# EAGLE design shift_clock_v2_0 (EAGLE 9.6.2)

## Sheet 1 of 6
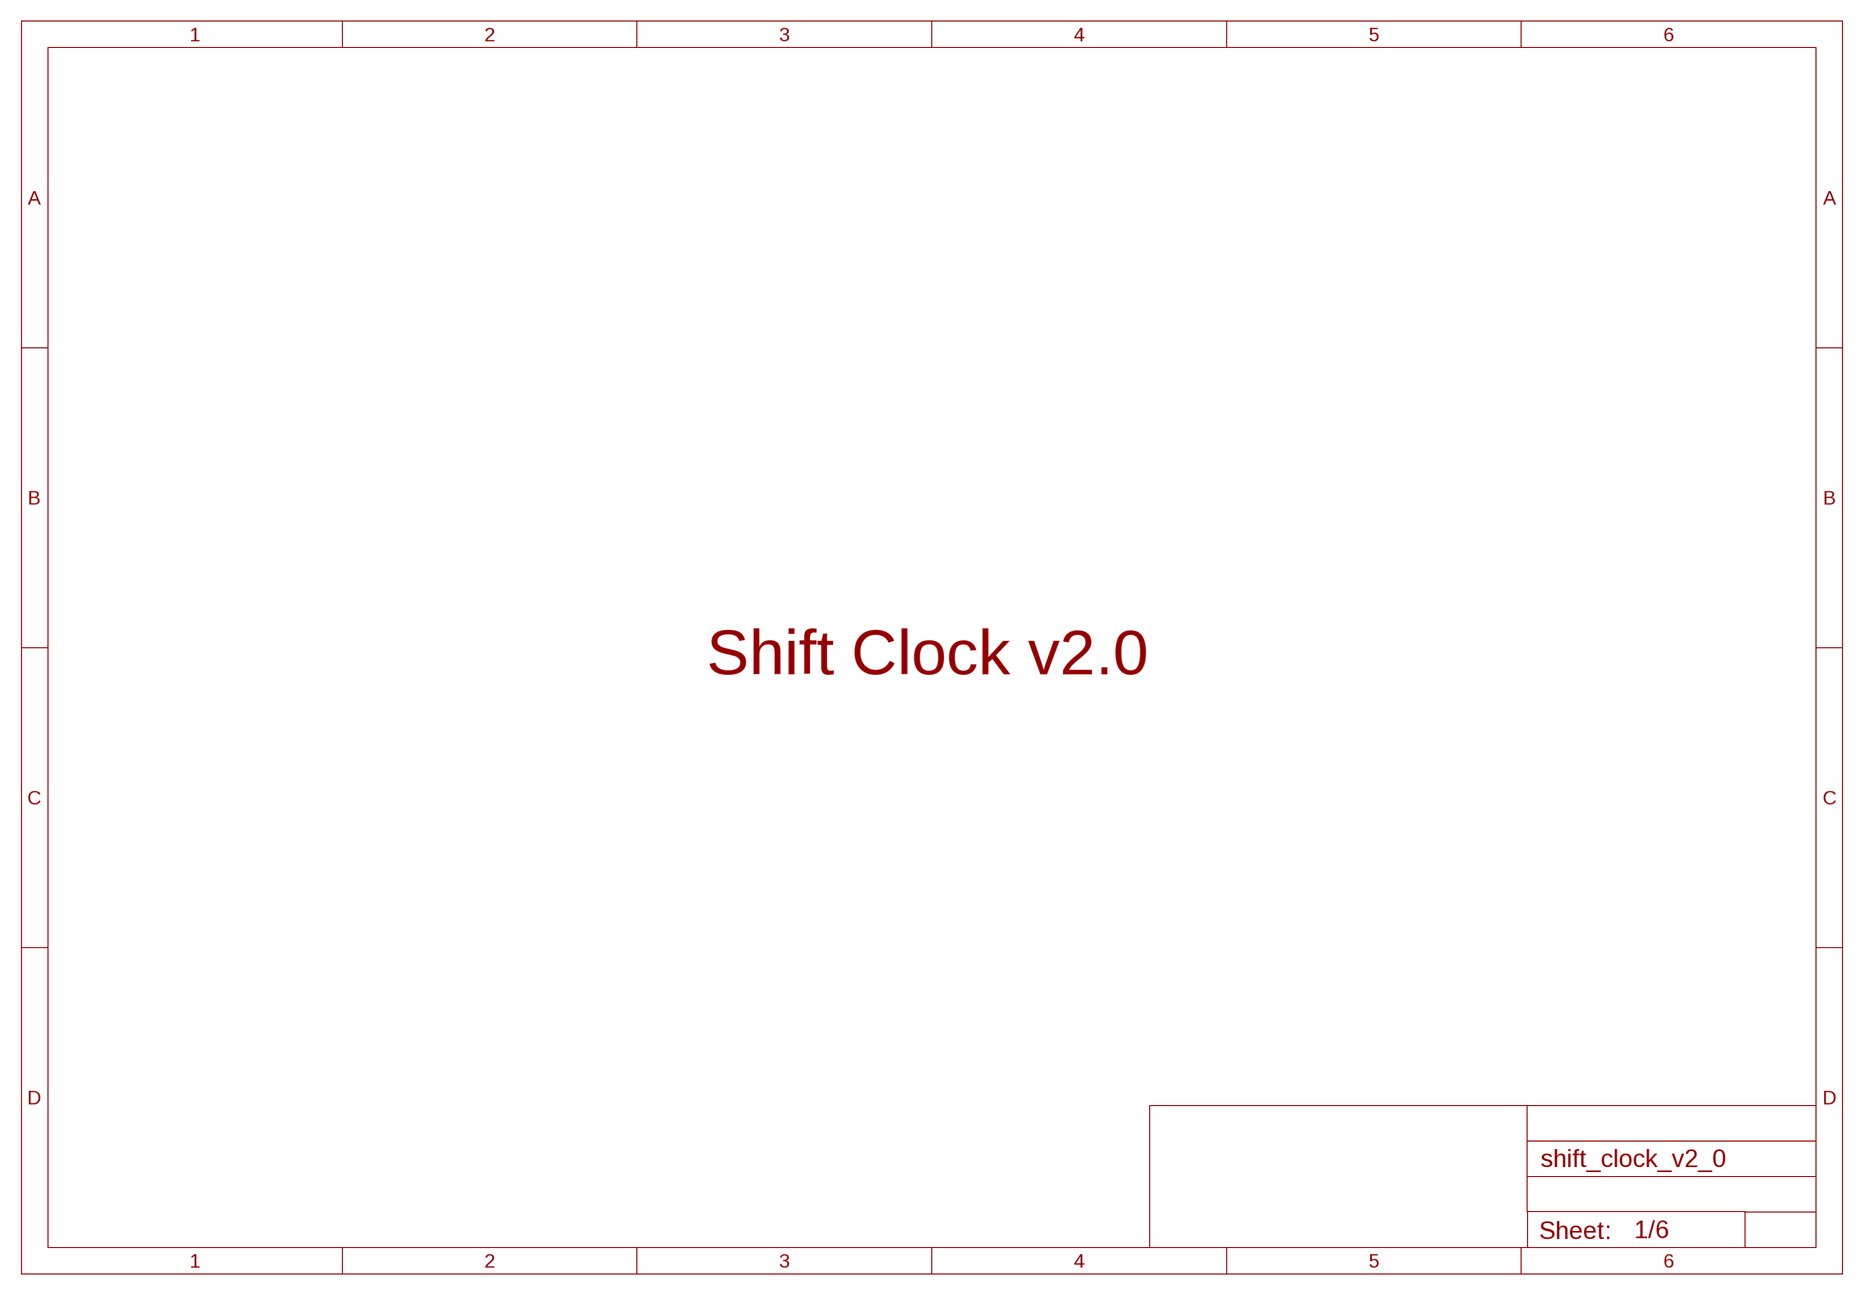
[diagram p0: schematic, sheet 1]

### Notes on the sheet
- Shift Clock v2.0

## Sheet 2 of 6
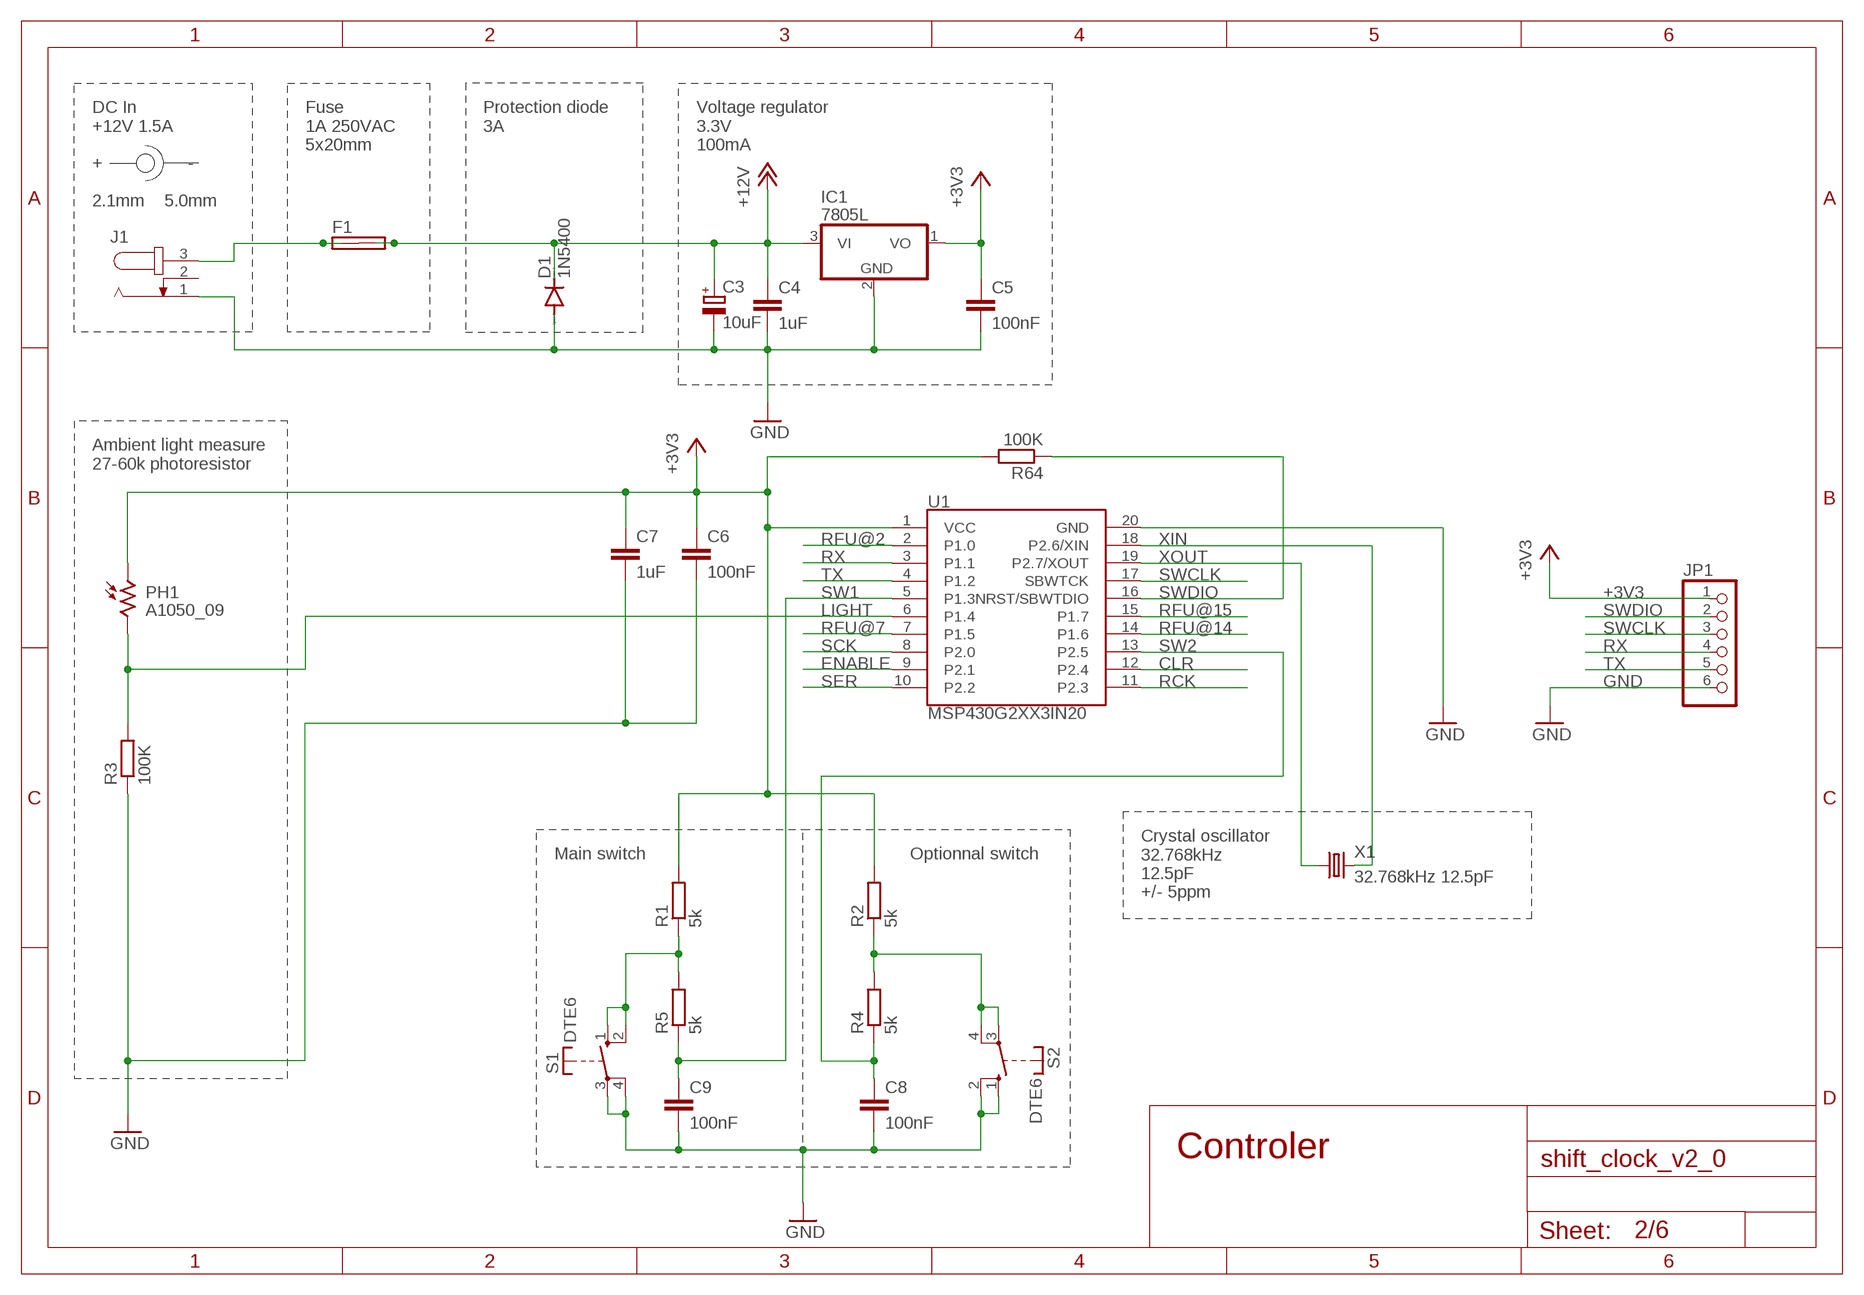
[diagram p1: schematic, sheet 2]

### Parts
C3  10uF  CPOL-EUE2.5-6  [E2,5-6]
C4  1uF  C-EU050-024X044  [C050-024X044]
C5  100nF  C-EU050-024X044  [C050-024X044]
C6  100nF  C-EU050-024X044  [C050-024X044]
C7  1uF  C-EU050-024X044  [C050-024X044]
C8  100nF  C-EU050-024X044  [C050-024X044]
C9  100nF  C-EU050-024X044  [C050-024X044]
D1  1N5400  [DO201-15]
F1  SHK20L  [SHK20L]
IC1  7805L  [TO92]
J1  JACK-PLUG0  [SPC4077]
JP1  PINHD-1X6  [1X06]
PH1  A1050_09  [T0-46-A10XX]
R1  5k  R-EU_0204/7  [0204/7]
R2  5k  R-EU_0204/7  [0204/7]
R3  100K  R-EU_0204/7  [0204/7]
R4  5k  R-EU_0204/7  [0204/7]
R5  5k  R-EU_0204/7  [0204/7]
R64  100K  R-EU_0204/7  [0204/7]
S1  DTE6  [DTE6]
S2  DTE6  [DTE6]
U1  MSP430G2XX3IN20  [DIL20]
X1  32.768kHz 12.5pF  CRYSTALTC26H  [TC26H]

### Nets
+3V3 [power_low]: C5.1 C6.1 C7.1 IC1.1(VO) JP1.1 PH1.1 R1.2 R2.2 R64.2 U1.1(VCC) ; also sheet 3,4,5,6
+12V [power_high]: C3.+ C4.1 D1.C F1.2A F1.2B IC1.3(VI) ; also sheet 3,4,5,6
CLR: U1.12(P2.4) ; also sheet 3,4,5,6
ENABLE: U1.9(P2.1) ; also sheet 3,4,5,6
GND: C3.- C4.2 C5.2 C6.2 C7.2 C8.2 C9.2 D1.A IC1.2(GND) J1.1 JP1.6 R3.1 S1.3(P) S1.4(P) S2.1(S) S2.2(S) U1.20(GND) ; also sheet 3,4,5,6
LIGHT: PH1.2 R3.2 U1.6(P1.4)
N$1 [power_high]: F1.1A F1.1B J1.3
N$3: R2.1 R4.2 S2.3(P) S2.4(P)
N$4: R1.1 R5.2 S1.1(S) S1.2(S)
RCK: U1.11(P2.3) ; also sheet 3,4,5,6
RFU@2: U1.2(P1.0)
RFU@7: U1.7(P1.5)
RFU@14: U1.14(P1.6)
RFU@15: U1.15(P1.7)
RX: JP1.4 U1.3(P1.1)
SCK: U1.8(P2.0) ; also sheet 3,4,5,6
SER: U1.10(P2.2) ; also sheet 3
SW1: C9.1 R5.1 U1.5(P1.3)
SW2: C8.1 R4.1 U1.13(P2.5)
SWCLK: JP1.3 U1.17(SBWTCK)
SWDIO: JP1.2 R64.1 U1.16(NRST/SBWTDIO)
TX: JP1.5 U1.4(P1.2)
XIN: U1.18(P2.6/XIN) X1.2
XOUT: U1.19(P2.7/XOUT) X1.1
Unconnected: J1.2

### Notes on the sheet
- DC In
  +12V 1.5A
  
  +                 -
  
  2.1mm    5.0mm
- Fuse
  1A 250VAC
  5x20mm
- Protection diode
  3A
- Voltage regulator
  3.3V
  100mA
- Ambient light measure
  27-60k photoresistor
- Crystal oscillator
  32.768kHz
  12.5pF
  +/- 5ppm
- Main switch | Optionnal switch
- Controler

## Sheet 3 of 6
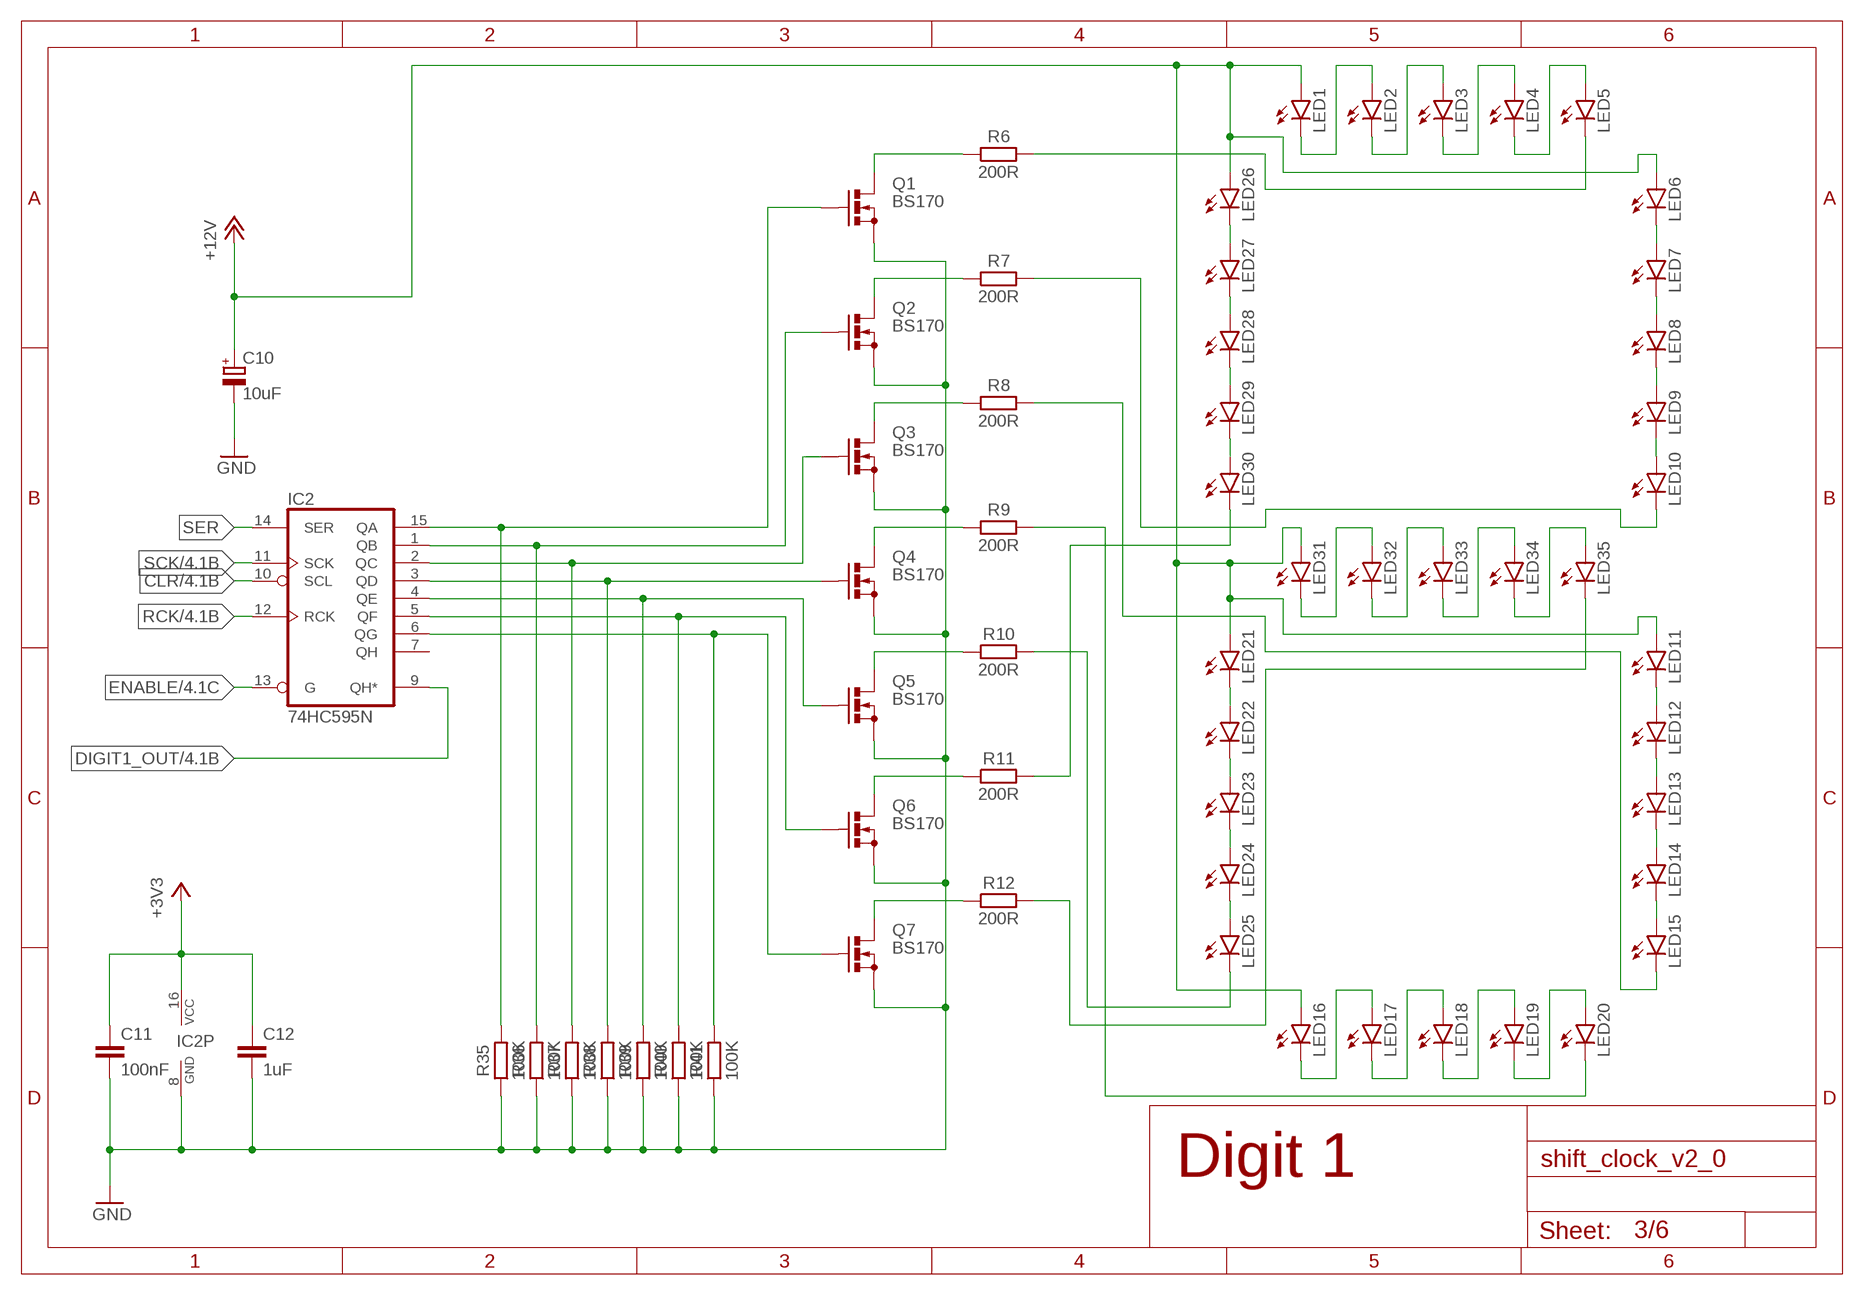
[diagram p2: schematic, sheet 3]

### Parts
C10  10uF  CPOL-EUE2.5-6  [E2,5-6]
C11  100nF  C-EU050-024X044  [C050-024X044]
C12  1uF  C-EU050-024X044  [C050-024X044]
IC2  74HC595N  [DIL16]
LED1  LED25X70  [LED25X70]
LED2  LED25X70  [LED25X70]
LED3  LED25X70  [LED25X70]
LED4  LED25X70  [LED25X70]
LED5  LED25X70  [LED25X70]
LED6  LED25X70  [LED25X70]
LED7  LED25X70  [LED25X70]
LED8  LED25X70  [LED25X70]
LED9  LED25X70  [LED25X70]
LED10  LED25X70  [LED25X70]
LED11  LED25X70  [LED25X70]
LED12  LED25X70  [LED25X70]
LED13  LED25X70  [LED25X70]
LED14  LED25X70  [LED25X70]
LED15  LED25X70  [LED25X70]
LED16  LED25X70  [LED25X70]
LED17  LED25X70  [LED25X70]
LED18  LED25X70  [LED25X70]
LED19  LED25X70  [LED25X70]
LED20  LED25X70  [LED25X70]
LED21  LED25X70  [LED25X70]
LED22  LED25X70  [LED25X70]
LED23  LED25X70  [LED25X70]
LED24  LED25X70  [LED25X70]
LED25  LED25X70  [LED25X70]
LED26  LED25X70  [LED25X70]
LED27  LED25X70  [LED25X70]
LED28  LED25X70  [LED25X70]
LED29  LED25X70  [LED25X70]
LED30  LED25X70  [LED25X70]
LED31  LED25X70  [LED25X70]
LED32  LED25X70  [LED25X70]
LED33  LED25X70  [LED25X70]
LED34  LED25X70  [LED25X70]
LED35  LED25X70  [LED25X70]
Q1  BS170  [SOT54E]
Q2  BS170  [SOT54E]
Q3  BS170  [SOT54E]
Q4  BS170  [SOT54E]
Q5  BS170  [SOT54E]
Q6  BS170  [SOT54E]
Q7  BS170  [SOT54E]
R6  200R  R-EU_0204/7  [0204/7]
R7  200R  R-EU_0204/7  [0204/7]
R8  200R  R-EU_0204/7  [0204/7]
R9  200R  R-EU_0204/7  [0204/7]
R10  200R  R-EU_0204/7  [0204/7]
R11  200R  R-EU_0204/7  [0204/7]
R12  200R  R-EU_0204/7  [0204/7]
R35  100K  R-EU_0204/7  [0204/7]
R36  100K  R-EU_0204/7  [0204/7]
R37  100K  R-EU_0204/7  [0204/7]
R38  100K  R-EU_0204/7  [0204/7]
R39  100K  R-EU_0204/7  [0204/7]
R40  100K  R-EU_0204/7  [0204/7]
R41  100K  R-EU_0204/7  [0204/7]

### Nets
+3V3 [power_low]: C11.1 C12.1 IC2.16(VCC) ; also sheet 2,4,5,6
+12V [power_high]: C10.+ LED1.A LED6.A LED11.A LED16.A LED21.A LED26.A LED31.A ; also sheet 2,4,5,6
CLR: IC2.10(SCL) ; also sheet 2,4,5,6
DIGIT1_OUT: IC2.9(QH*) ; also sheet 4
ENABLE: IC2.13(G) ; also sheet 2,4,5,6
GND: C10.- C11.2 C12.2 IC2.8(GND) Q1.S Q2.S Q3.S Q4.S Q5.S Q6.S Q7.S R35.1 R36.1 R37.1 R38.1 R39.1 R40.1 R41.1 ; also sheet 2,4,5,6
N$2: LED1.K(C) LED2.A
N$5: LED2.K(C) LED3.A
N$6: LED3.K(C) LED4.A
N$7: LED4.K(C) LED5.A
N$8: LED6.K(C) LED7.A
N$9: LED7.K(C) LED8.A
N$10: LED8.K(C) LED9.A
N$11: LED9.K(C) LED10.A
N$12: LED26.K(C) LED27.A
N$13: LED27.K(C) LED28.A
N$14: LED28.K(C) LED29.A
N$15: LED29.K(C) LED30.A
N$16: LED31.K(C) LED32.A
N$17: LED32.K(C) LED33.A
N$18: LED33.K(C) LED34.A
N$19: LED34.K(C) LED35.A
N$20: LED21.K(C) LED22.A
N$21: LED22.K(C) LED23.A
N$22: LED23.K(C) LED24.A
N$23: LED24.K(C) LED25.A
N$24: LED11.K(C) LED12.A
N$25: LED12.K(C) LED13.A
N$26: LED13.K(C) LED14.A
N$27: LED14.K(C) LED15.A
N$28: LED16.K(C) LED17.A
N$29: LED17.K(C) LED18.A
N$30: LED18.K(C) LED19.A
N$31: LED19.K(C) LED20.A
N$32: IC2.15(QA) Q1.G R35.2
N$33: IC2.1(QB) Q2.G R36.2
N$34: IC2.2(QC) Q3.G R37.2
N$35: IC2.3(QD) Q4.G R38.2
N$36: IC2.4(QE) Q5.G R39.2
N$37: IC2.5(QF) Q6.G R40.2
N$38: IC2.6(QG) Q7.G R41.2
N$39: Q1.D R6.1
N$40: Q2.D R7.1
N$41: Q3.D R8.1
N$42: Q4.D R9.1
N$43: Q5.D R10.1
N$44: Q6.D R11.1
N$45: Q7.D R12.1
N$46: LED5.K(C) R6.2
N$47: LED10.K(C) R7.2
N$48: LED15.K(C) R8.2
N$49: LED20.K(C) R9.2
N$50: LED25.K(C) R10.2
N$51: LED30.K(C) R11.2
N$52: LED35.K(C) R12.2
RCK: IC2.12(RCK) ; also sheet 2,4,5,6
SCK: IC2.11(SCK) ; also sheet 2,4,5,6
SER: IC2.14(SER) ; also sheet 2
Unconnected: IC2.7(QH)

### Notes on the sheet
- Digit 1

## Sheet 4 of 6
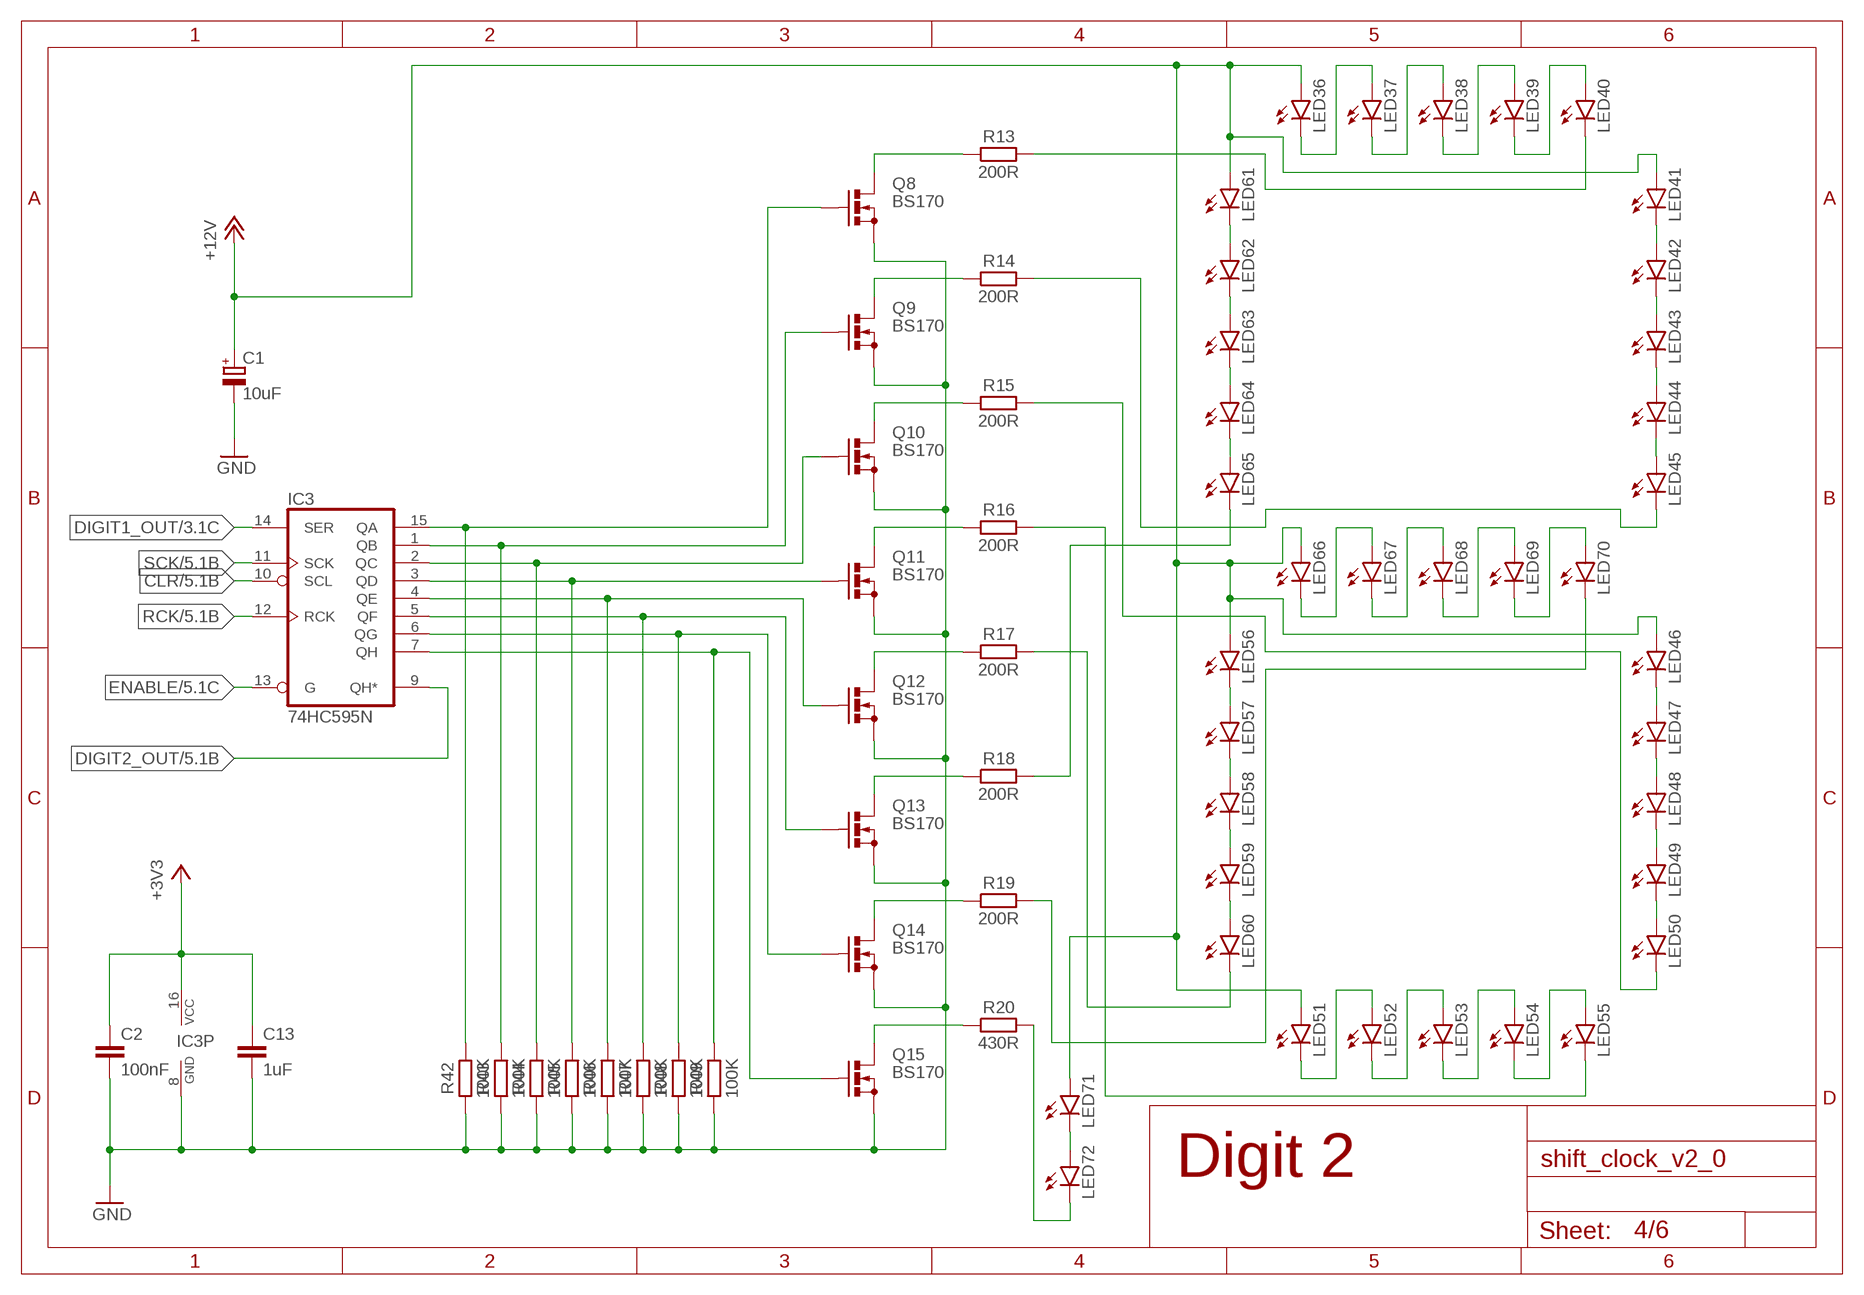
[diagram p3: schematic, sheet 4]

### Parts
C1  10uF  CPOL-EUE2.5-6  [E2,5-6]
C2  100nF  C-EU050-024X044  [C050-024X044]
C13  1uF  C-EU050-024X044  [C050-024X044]
IC3  74HC595N  [DIL16]
LED36  LED25X70  [LED25X70]
LED37  LED25X70  [LED25X70]
LED38  LED25X70  [LED25X70]
LED39  LED25X70  [LED25X70]
LED40  LED25X70  [LED25X70]
LED41  LED25X70  [LED25X70]
LED42  LED25X70  [LED25X70]
LED43  LED25X70  [LED25X70]
LED44  LED25X70  [LED25X70]
LED45  LED25X70  [LED25X70]
LED46  LED25X70  [LED25X70]
LED47  LED25X70  [LED25X70]
LED48  LED25X70  [LED25X70]
LED49  LED25X70  [LED25X70]
LED50  LED25X70  [LED25X70]
LED51  LED25X70  [LED25X70]
LED52  LED25X70  [LED25X70]
LED53  LED25X70  [LED25X70]
LED54  LED25X70  [LED25X70]
LED55  LED25X70  [LED25X70]
LED56  LED25X70  [LED25X70]
LED57  LED25X70  [LED25X70]
LED58  LED25X70  [LED25X70]
LED59  LED25X70  [LED25X70]
LED60  LED25X70  [LED25X70]
LED61  LED25X70  [LED25X70]
LED62  LED25X70  [LED25X70]
LED63  LED25X70  [LED25X70]
LED64  LED25X70  [LED25X70]
LED65  LED25X70  [LED25X70]
LED66  LED25X70  [LED25X70]
LED67  LED25X70  [LED25X70]
LED68  LED25X70  [LED25X70]
LED69  LED25X70  [LED25X70]
LED70  LED25X70  [LED25X70]
LED71  LED25X70  [LED25X70]
LED72  LED25X70  [LED25X70]
Q8  BS170  [SOT54E]
Q9  BS170  [SOT54E]
Q10  BS170  [SOT54E]
Q11  BS170  [SOT54E]
Q12  BS170  [SOT54E]
Q13  BS170  [SOT54E]
Q14  BS170  [SOT54E]
Q15  BS170  [SOT54E]
R13  200R  R-EU_0204/7  [0204/7]
R14  200R  R-EU_0204/7  [0204/7]
R15  200R  R-EU_0204/7  [0204/7]
R16  200R  R-EU_0204/7  [0204/7]
R17  200R  R-EU_0204/7  [0204/7]
R18  200R  R-EU_0204/7  [0204/7]
R19  200R  R-EU_0204/7  [0204/7]
R20  430R  R-EU_0204/7  [0204/7]
R42  100K  R-EU_0204/7  [0204/7]
R43  100K  R-EU_0204/7  [0204/7]
R44  100K  R-EU_0204/7  [0204/7]
R45  100K  R-EU_0204/7  [0204/7]
R46  100K  R-EU_0204/7  [0204/7]
R47  100K  R-EU_0204/7  [0204/7]
R48  100K  R-EU_0204/7  [0204/7]
R49  100K  R-EU_0204/7  [0204/7]

### Nets
+3V3 [power_low]: C2.1 C13.1 IC3.16(VCC) ; also sheet 2,3,5,6
+12V [power_high]: C1.+ LED36.A LED41.A LED46.A LED51.A LED56.A LED61.A LED66.A LED71.A ; also sheet 2,3,5,6
CLR: IC3.10(SCL) ; also sheet 2,3,5,6
DIGIT1_OUT: IC3.14(SER) ; also sheet 3
DIGIT2_OUT: IC3.9(QH*) ; also sheet 5
ENABLE: IC3.13(G) ; also sheet 2,3,5,6
GND: C1.- C2.2 C13.2 IC3.8(GND) Q8.S Q9.S Q10.S Q11.S Q12.S Q13.S Q14.S Q15.S R42.1 R43.1 R44.1 R45.1 R46.1 R47.1 R48.1 R49.1 ; also sheet 2,3,5,6
N$53: LED36.K(C) LED37.A
N$54: LED37.K(C) LED38.A
N$55: LED38.K(C) LED39.A
N$56: LED39.K(C) LED40.A
N$57: LED41.K(C) LED42.A
N$58: LED42.K(C) LED43.A
N$59: LED43.K(C) LED44.A
N$60: LED44.K(C) LED45.A
N$61: LED61.K(C) LED62.A
N$62: LED62.K(C) LED63.A
N$63: LED63.K(C) LED64.A
N$64: LED64.K(C) LED65.A
N$65: LED66.K(C) LED67.A
N$66: LED67.K(C) LED68.A
N$67: LED68.K(C) LED69.A
N$68: LED69.K(C) LED70.A
N$69: LED56.K(C) LED57.A
N$70: LED57.K(C) LED58.A
N$71: LED58.K(C) LED59.A
N$72: LED59.K(C) LED60.A
N$73: LED46.K(C) LED47.A
N$74: LED47.K(C) LED48.A
N$75: LED48.K(C) LED49.A
N$76: LED49.K(C) LED50.A
N$77: LED51.K(C) LED52.A
N$78: LED52.K(C) LED53.A
N$79: LED53.K(C) LED54.A
N$80: LED54.K(C) LED55.A
N$81: IC3.15(QA) Q8.G R42.2
N$82: IC3.1(QB) Q9.G R43.2
N$83: IC3.2(QC) Q10.G R44.2
N$84: IC3.3(QD) Q11.G R45.2
N$85: IC3.4(QE) Q12.G R46.2
N$86: IC3.5(QF) Q13.G R47.2
N$87: IC3.6(QG) Q14.G R48.2
N$88: Q8.D R13.1
N$89: Q9.D R14.1
N$90: Q10.D R15.1
N$91: Q11.D R16.1
N$92: Q12.D R17.1
N$93: Q13.D R18.1
N$94: Q14.D R19.1
N$95: LED40.K(C) R13.2
N$96: LED45.K(C) R14.2
N$97: LED50.K(C) R15.2
N$98: LED55.K(C) R16.2
N$99: LED60.K(C) R17.2
N$100: LED65.K(C) R18.2
N$101: LED70.K(C) R19.2
N$102: LED71.K(C) LED72.A
N$103: LED72.K(C) R20.2
N$104: Q15.D R20.1
N$105: IC3.7(QH) Q15.G R49.2
RCK: IC3.12(RCK) ; also sheet 2,3,5,6
SCK: IC3.11(SCK) ; also sheet 2,3,5,6

### Notes on the sheet
- Digit 2

## Sheet 5 of 6
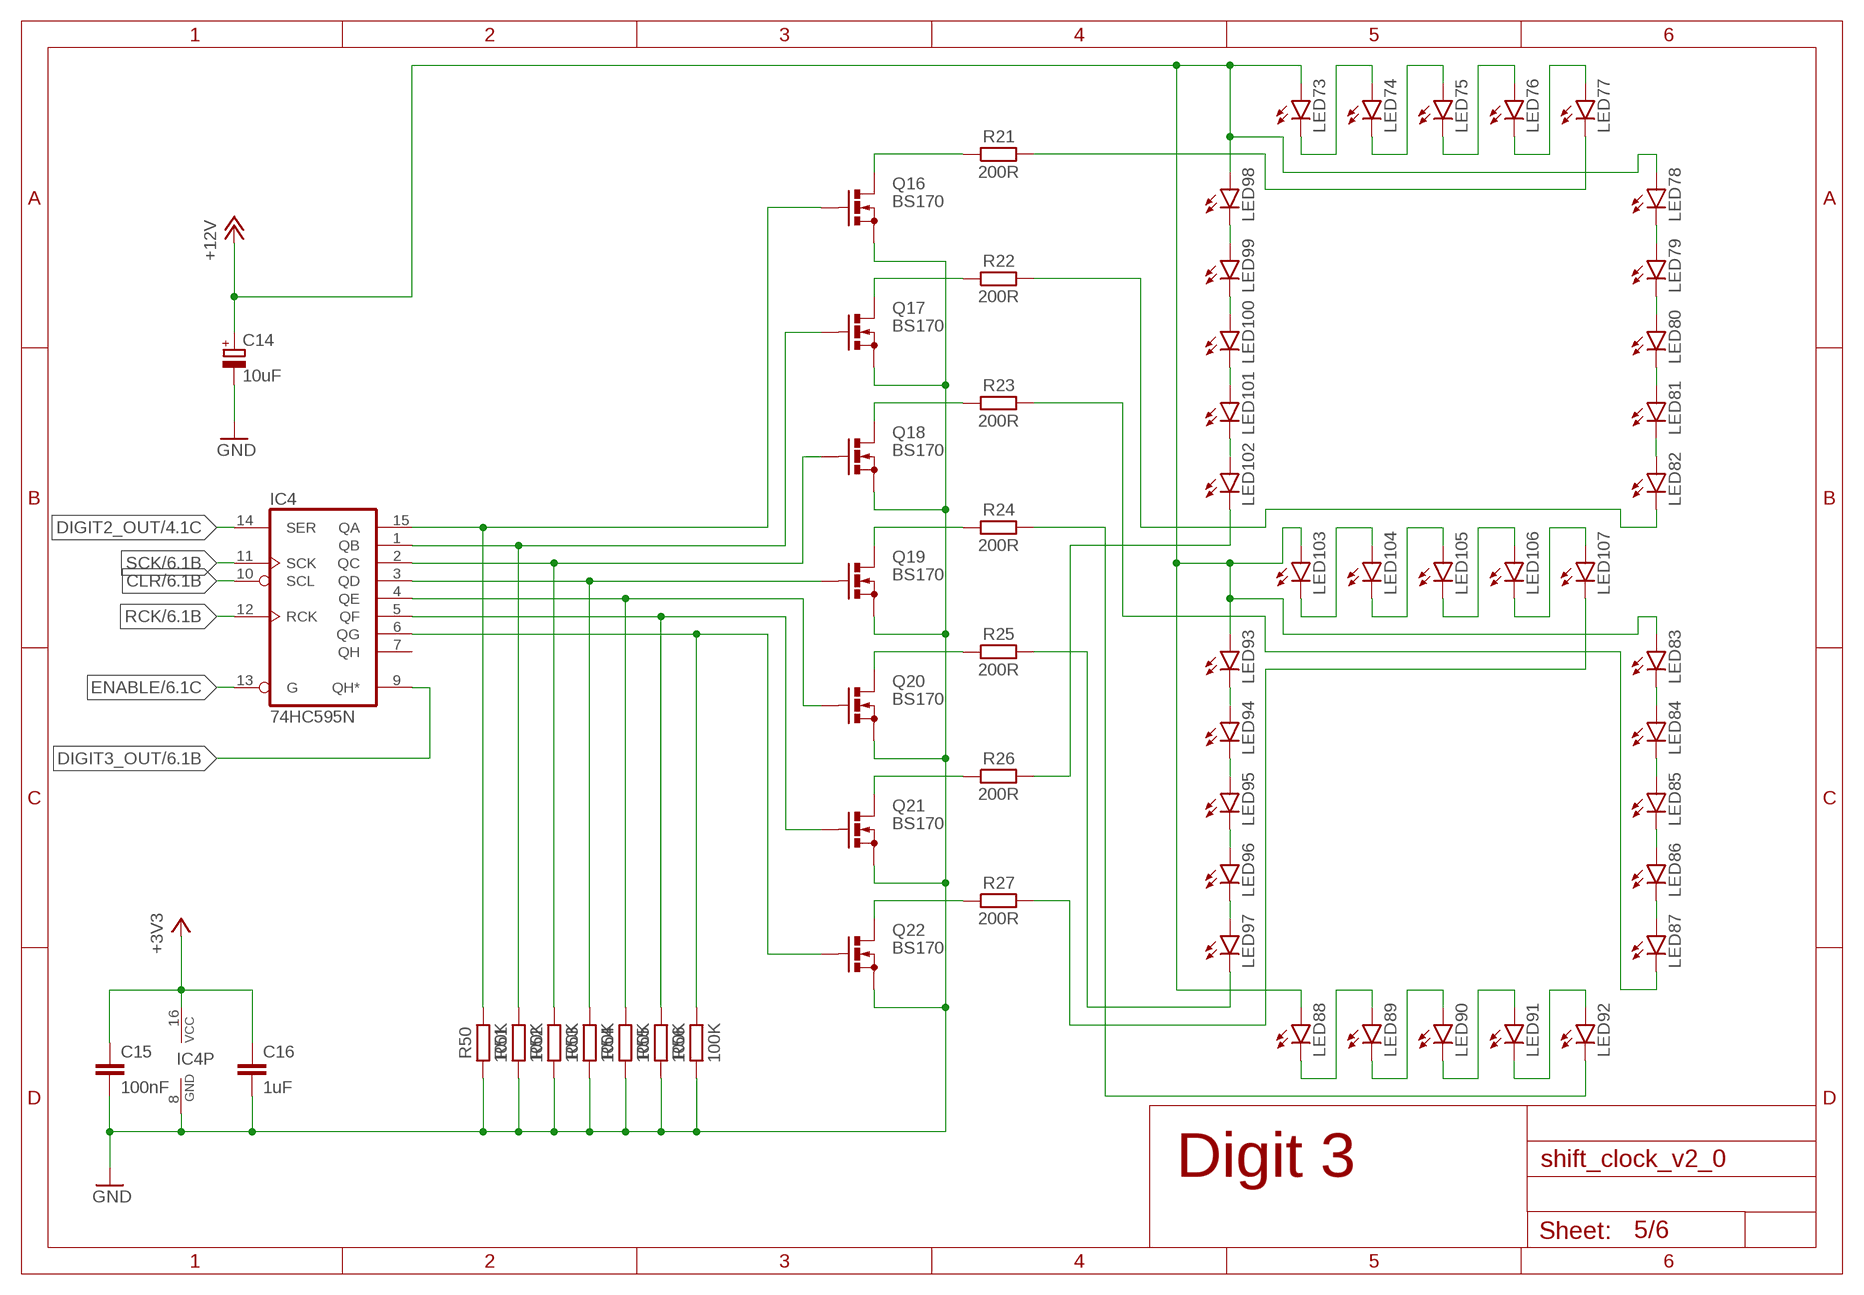
[diagram p4: schematic, sheet 5]

### Parts
C14  10uF  CPOL-EUE2.5-6  [E2,5-6]
C15  100nF  C-EU050-024X044  [C050-024X044]
C16  1uF  C-EU050-024X044  [C050-024X044]
IC4  74HC595N  [DIL16]
LED73  LED25X70  [LED25X70]
LED74  LED25X70  [LED25X70]
LED75  LED25X70  [LED25X70]
LED76  LED25X70  [LED25X70]
LED77  LED25X70  [LED25X70]
LED78  LED25X70  [LED25X70]
LED79  LED25X70  [LED25X70]
LED80  LED25X70  [LED25X70]
LED81  LED25X70  [LED25X70]
LED82  LED25X70  [LED25X70]
LED83  LED25X70  [LED25X70]
LED84  LED25X70  [LED25X70]
LED85  LED25X70  [LED25X70]
LED86  LED25X70  [LED25X70]
LED87  LED25X70  [LED25X70]
LED88  LED25X70  [LED25X70]
LED89  LED25X70  [LED25X70]
LED90  LED25X70  [LED25X70]
LED91  LED25X70  [LED25X70]
LED92  LED25X70  [LED25X70]
LED93  LED25X70  [LED25X70]
LED94  LED25X70  [LED25X70]
LED95  LED25X70  [LED25X70]
LED96  LED25X70  [LED25X70]
LED97  LED25X70  [LED25X70]
LED98  LED25X70  [LED25X70]
LED99  LED25X70  [LED25X70]
LED100  LED25X70  [LED25X70]
LED101  LED25X70  [LED25X70]
LED102  LED25X70  [LED25X70]
LED103  LED25X70  [LED25X70]
LED104  LED25X70  [LED25X70]
LED105  LED25X70  [LED25X70]
LED106  LED25X70  [LED25X70]
LED107  LED25X70  [LED25X70]
Q16  BS170  [SOT54E]
Q17  BS170  [SOT54E]
Q18  BS170  [SOT54E]
Q19  BS170  [SOT54E]
Q20  BS170  [SOT54E]
Q21  BS170  [SOT54E]
Q22  BS170  [SOT54E]
R21  200R  R-EU_0204/7  [0204/7]
R22  200R  R-EU_0204/7  [0204/7]
R23  200R  R-EU_0204/7  [0204/7]
R24  200R  R-EU_0204/7  [0204/7]
R25  200R  R-EU_0204/7  [0204/7]
R26  200R  R-EU_0204/7  [0204/7]
R27  200R  R-EU_0204/7  [0204/7]
R50  100K  R-EU_0204/7  [0204/7]
R51  100K  R-EU_0204/7  [0204/7]
R52  100K  R-EU_0204/7  [0204/7]
R53  100K  R-EU_0204/7  [0204/7]
R54  100K  R-EU_0204/7  [0204/7]
R55  100K  R-EU_0204/7  [0204/7]
R56  100K  R-EU_0204/7  [0204/7]

### Nets
+3V3 [power_low]: C15.1 C16.1 IC4.16(VCC) ; also sheet 2,3,4,6
+12V [power_high]: C14.+ LED73.A LED78.A LED83.A LED88.A LED93.A LED98.A LED103.A ; also sheet 2,3,4,6
CLR: IC4.10(SCL) ; also sheet 2,3,4,6
DIGIT2_OUT: IC4.14(SER) ; also sheet 4
DIGIT3_OUT: IC4.9(QH*) ; also sheet 6
ENABLE: IC4.13(G) ; also sheet 2,3,4,6
GND: C14.- C15.2 C16.2 IC4.8(GND) Q16.S Q17.S Q18.S Q19.S Q20.S Q21.S Q22.S R50.1 R51.1 R52.1 R53.1 R54.1 R55.1 R56.1 ; also sheet 2,3,4,6
N$106: LED73.K(C) LED74.A
N$107: LED74.K(C) LED75.A
N$108: LED75.K(C) LED76.A
N$109: LED76.K(C) LED77.A
N$110: LED78.K(C) LED79.A
N$111: LED79.K(C) LED80.A
N$112: LED80.K(C) LED81.A
N$113: LED81.K(C) LED82.A
N$114: LED98.K(C) LED99.A
N$115: LED99.K(C) LED100.A
N$116: LED100.K(C) LED101.A
N$117: LED101.K(C) LED102.A
N$118: LED103.K(C) LED104.A
N$119: LED104.K(C) LED105.A
N$120: LED105.K(C) LED106.A
N$121: LED106.K(C) LED107.A
N$122: LED93.K(C) LED94.A
N$123: LED94.K(C) LED95.A
N$124: LED95.K(C) LED96.A
N$125: LED96.K(C) LED97.A
N$126: LED83.K(C) LED84.A
N$127: LED84.K(C) LED85.A
N$128: LED85.K(C) LED86.A
N$129: LED86.K(C) LED87.A
N$130: LED88.K(C) LED89.A
N$131: LED89.K(C) LED90.A
N$132: LED90.K(C) LED91.A
N$133: LED91.K(C) LED92.A
N$134: IC4.15(QA) Q16.G R50.2
N$135: IC4.1(QB) Q17.G R51.2
N$136: IC4.2(QC) Q18.G R52.2
N$137: IC4.3(QD) Q19.G R53.2
N$138: IC4.4(QE) Q20.G R54.2
N$140: IC4.6(QG) Q22.G R56.2
N$141: Q16.D R21.1
N$142: Q17.D R22.1
N$143: Q18.D R23.1
N$144: Q19.D R24.1
N$145: Q20.D R25.1
N$146: Q21.D R26.1
N$147: Q22.D R27.1
N$148: LED77.K(C) R21.2
N$149: LED82.K(C) R22.2
N$150: LED87.K(C) R23.2
N$151: LED92.K(C) R24.2
N$152: LED97.K(C) R25.2
N$153: LED102.K(C) R26.2
N$154: LED107.K(C) R27.2
N$204: IC4.5(QF) Q21.G R55.2
RCK: IC4.12(RCK) ; also sheet 2,3,4,6
SCK: IC4.11(SCK) ; also sheet 2,3,4,6
Unconnected: IC4.7(QH)

### Notes on the sheet
- Digit 3

## Sheet 6 of 6
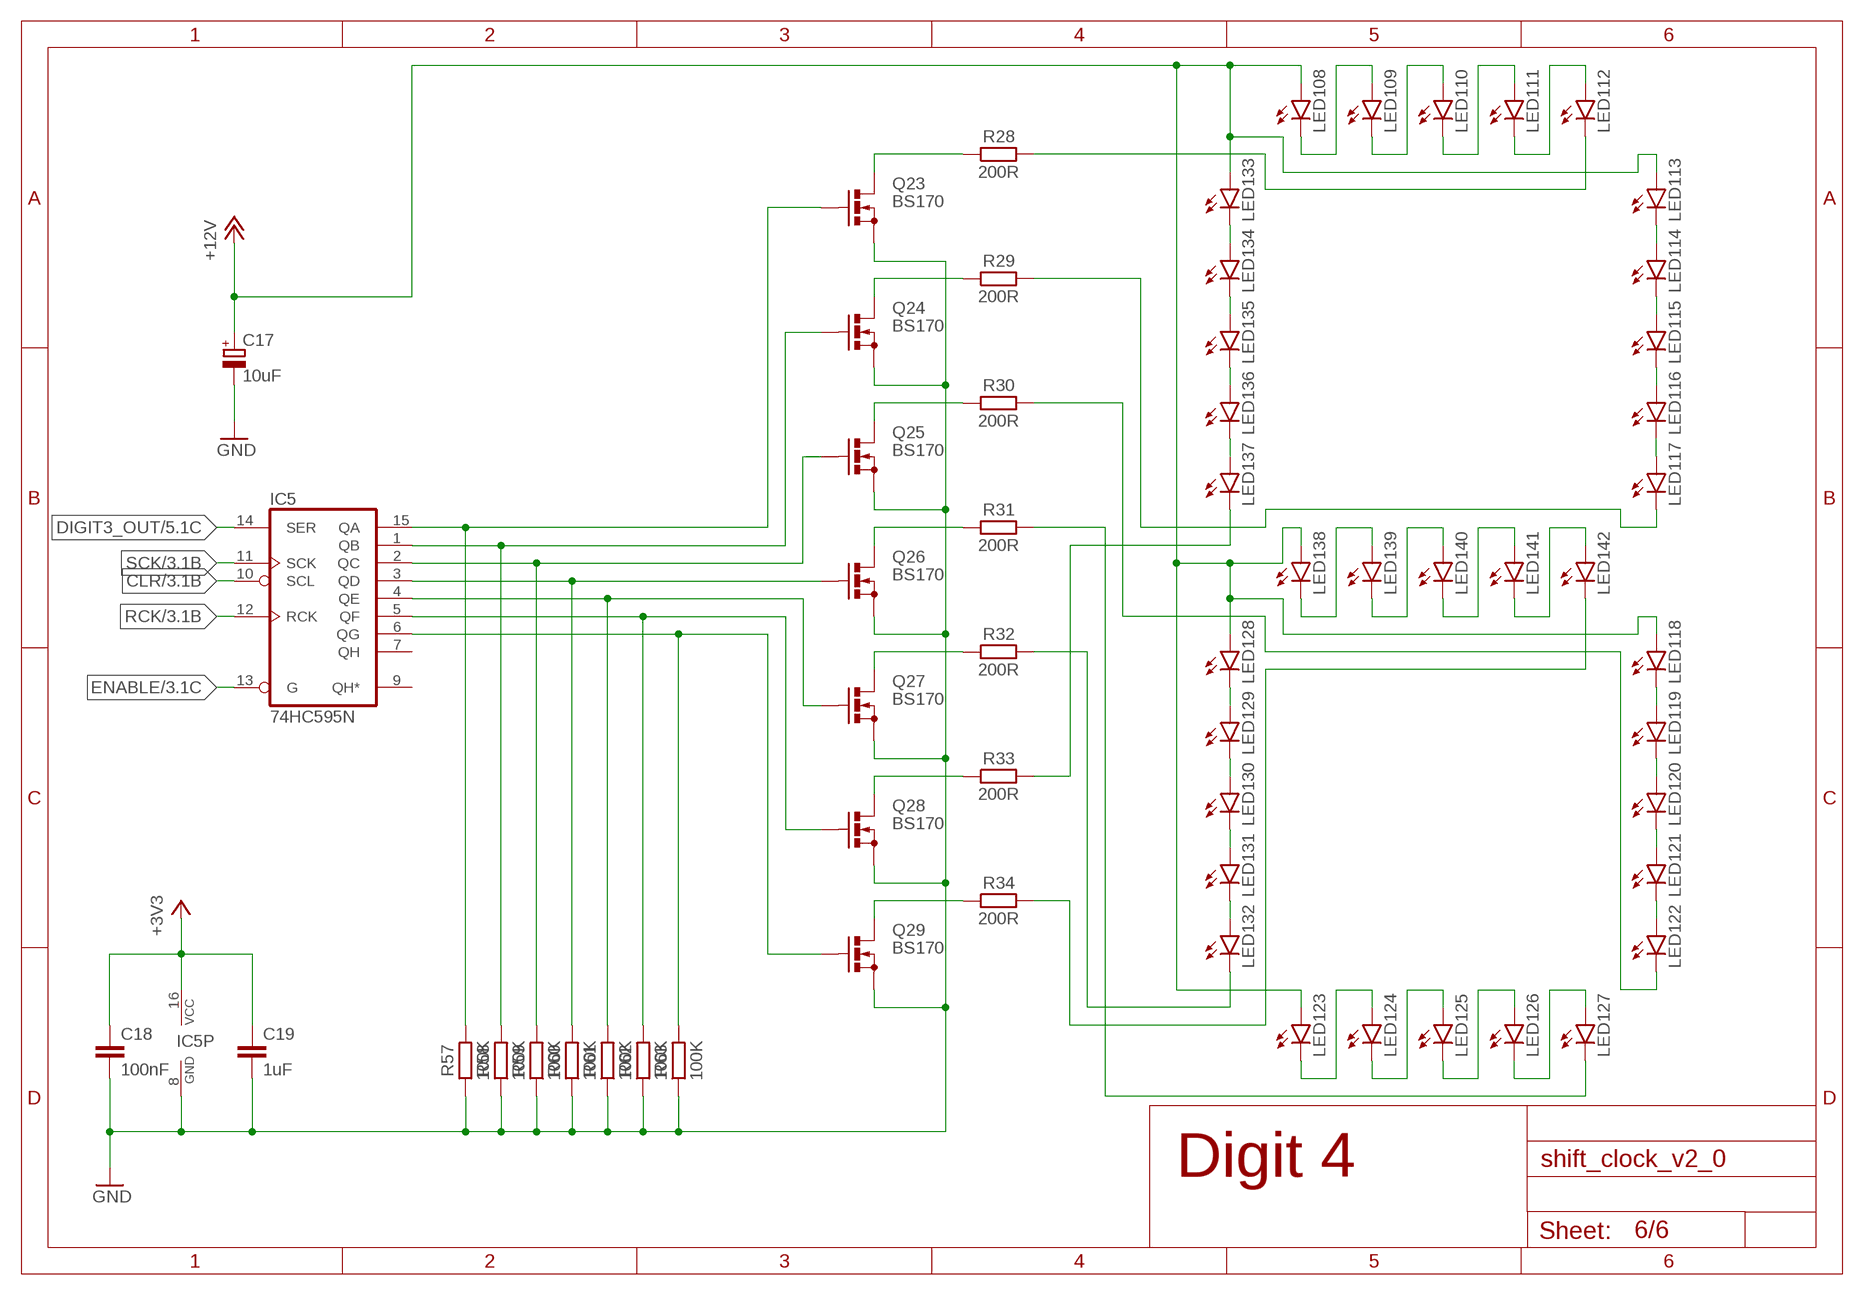
[diagram p5: schematic, sheet 6]

### Parts
C17  10uF  CPOL-EUE2.5-6  [E2,5-6]
C18  100nF  C-EU050-024X044  [C050-024X044]
C19  1uF  C-EU050-024X044  [C050-024X044]
IC5  74HC595N  [DIL16]
LED108  LED25X70  [LED25X70]
LED109  LED25X70  [LED25X70]
LED110  LED25X70  [LED25X70]
LED111  LED25X70  [LED25X70]
LED112  LED25X70  [LED25X70]
LED113  LED25X70  [LED25X70]
LED114  LED25X70  [LED25X70]
LED115  LED25X70  [LED25X70]
LED116  LED25X70  [LED25X70]
LED117  LED25X70  [LED25X70]
LED118  LED25X70  [LED25X70]
LED119  LED25X70  [LED25X70]
LED120  LED25X70  [LED25X70]
LED121  LED25X70  [LED25X70]
LED122  LED25X70  [LED25X70]
LED123  LED25X70  [LED25X70]
LED124  LED25X70  [LED25X70]
LED125  LED25X70  [LED25X70]
LED126  LED25X70  [LED25X70]
LED127  LED25X70  [LED25X70]
LED128  LED25X70  [LED25X70]
LED129  LED25X70  [LED25X70]
LED130  LED25X70  [LED25X70]
LED131  LED25X70  [LED25X70]
LED132  LED25X70  [LED25X70]
LED133  LED25X70  [LED25X70]
LED134  LED25X70  [LED25X70]
LED135  LED25X70  [LED25X70]
LED136  LED25X70  [LED25X70]
LED137  LED25X70  [LED25X70]
LED138  LED25X70  [LED25X70]
LED139  LED25X70  [LED25X70]
LED140  LED25X70  [LED25X70]
LED141  LED25X70  [LED25X70]
LED142  LED25X70  [LED25X70]
Q23  BS170  [SOT54E]
Q24  BS170  [SOT54E]
Q25  BS170  [SOT54E]
Q26  BS170  [SOT54E]
Q27  BS170  [SOT54E]
Q28  BS170  [SOT54E]
Q29  BS170  [SOT54E]
R28  200R  R-EU_0204/7  [0204/7]
R29  200R  R-EU_0204/7  [0204/7]
R30  200R  R-EU_0204/7  [0204/7]
R31  200R  R-EU_0204/7  [0204/7]
R32  200R  R-EU_0204/7  [0204/7]
R33  200R  R-EU_0204/7  [0204/7]
R34  200R  R-EU_0204/7  [0204/7]
R57  100K  R-EU_0204/7  [0204/7]
R58  100K  R-EU_0204/7  [0204/7]
R59  100K  R-EU_0204/7  [0204/7]
R60  100K  R-EU_0204/7  [0204/7]
R61  100K  R-EU_0204/7  [0204/7]
R62  100K  R-EU_0204/7  [0204/7]
R63  100K  R-EU_0204/7  [0204/7]

### Nets
+3V3 [power_low]: C18.1 C19.1 IC5.16(VCC) ; also sheet 2,3,4,5
+12V [power_high]: C17.+ LED108.A LED113.A LED118.A LED123.A LED128.A LED133.A LED138.A ; also sheet 2,3,4,5
CLR: IC5.10(SCL) ; also sheet 2,3,4,5
DIGIT3_OUT: IC5.14(SER) ; also sheet 5
ENABLE: IC5.13(G) ; also sheet 2,3,4,5
GND: C17.- C18.2 C19.2 IC5.8(GND) Q23.S Q24.S Q25.S Q26.S Q27.S Q28.S Q29.S R57.1 R58.1 R59.1 R60.1 R61.1 R62.1 R63.1 ; also sheet 2,3,4,5
N$155: LED108.K(C) LED109.A
N$156: LED109.K(C) LED110.A
N$157: LED110.K(C) LED111.A
N$158: LED111.K(C) LED112.A
N$159: LED113.K(C) LED114.A
N$160: LED114.K(C) LED115.A
N$161: LED115.K(C) LED116.A
N$162: LED116.K(C) LED117.A
N$163: LED133.K(C) LED134.A
N$164: LED134.K(C) LED135.A
N$165: LED135.K(C) LED136.A
N$166: LED136.K(C) LED137.A
N$167: LED138.K(C) LED139.A
N$168: LED139.K(C) LED140.A
N$169: LED140.K(C) LED141.A
N$170: LED141.K(C) LED142.A
N$171: LED128.K(C) LED129.A
N$172: LED129.K(C) LED130.A
N$173: LED130.K(C) LED131.A
N$174: LED131.K(C) LED132.A
N$175: LED118.K(C) LED119.A
N$176: LED119.K(C) LED120.A
N$177: LED120.K(C) LED121.A
N$178: LED121.K(C) LED122.A
N$179: LED123.K(C) LED124.A
N$180: LED124.K(C) LED125.A
N$181: LED125.K(C) LED126.A
N$182: LED126.K(C) LED127.A
N$183: IC5.15(QA) Q23.G R57.2
N$184: IC5.1(QB) Q24.G R58.2
N$185: IC5.2(QC) Q25.G R59.2
N$186: IC5.3(QD) Q26.G R60.2
N$187: IC5.4(QE) Q27.G R61.2
N$188: IC5.5(QF) Q28.G R62.2
N$189: IC5.6(QG) Q29.G R63.2
N$190: Q23.D R28.1
N$191: Q24.D R29.1
N$192: Q25.D R30.1
N$193: Q26.D R31.1
N$194: Q27.D R32.1
N$195: Q28.D R33.1
N$196: Q29.D R34.1
N$197: LED112.K(C) R28.2
N$198: LED117.K(C) R29.2
N$199: LED122.K(C) R30.2
N$200: LED127.K(C) R31.2
N$201: LED132.K(C) R32.2
N$202: LED137.K(C) R33.2
N$203: LED142.K(C) R34.2
RCK: IC5.12(RCK) ; also sheet 2,3,4,5
SCK: IC5.11(SCK) ; also sheet 2,3,4,5
Unconnected: IC5.7(QH) IC5.9(QH*)

### Notes on the sheet
- Digit 4

## Library data of the parts
C1 C3 C10 C14 C17 = custom:CPOL-EU: POLARIZED CAPACITOR, European symbol; SPICEPREFIX: C
C2 C4-C9 C11-C13 C15 C16 C18 C19 = custom:C-EU: CAPACITOR, European symbol; SPICEPREFIX: C
D1 = custom:1N5400: DIODE standard rectifier, 3 A, 50 V (Motorola)
F1 = custom:SHK20L: FUSE HOLDER 5 x 20 mm, SH contact, SHH1 Schukat, E1073 Buerklin; OC_FARNELL: unknown; OC_NEWARK: unknown
IC1 = custom:78*: Positive VOLTAGE REGULATOR Source: http://cache.national.com/ds/LM/LM78L05.pdf http://www.fairchildsemi.com/ds/LM/LM7805.pdf
IC2-IC5 = custom:74*595: 8-bit SHIFT REGISTER, output latch
J1 = custom:JACK-PLUG: DC POWER JACK Power Jack, DC, Right Angle, Through Hole, Rated 5A at 16VDC, PC Terminals Distributor: Farnell (www.Farnell.de) Drawing: 84N1161.pdf / 84N1162.pdf Manufacturer: SPC Technology (www.spctechnology.com) Type: SPC4077 / SPC 4078; OC_FARNELL: unknown; OC_NEWARK: unknown
JP1 = pinhead:PINHD-1X6: PIN HEADER
LED1-LED142 = custom:LED: LED OSRAM: - CHIPLED LG R971, LG N971, LY N971, LG Q971, LY Q971, LO R971, LY R971 LH N974, LH R974 LS Q976, LO Q976, LY Q976 LO Q996 - Hyper CHIPLED LW Q18S LB Q993, LB Q99A, LB R99A - SideLED LS A670, LO A670, LY A670, LG A670, LP A670 LB A673, LV A673, LT A673, LW A673 LH A674 LY A675 LS A676, LA A676, LO A676, LY A676, LW A676 LS A679, LY A679, LG A679 - Hyper Micro SIDELED® LS Y876, LA Y876, LO Y876, LY Y876 LT Y87S - SmartLED LW L88C, LW L88S LB L89C, LB L89S, LG L890 LS L89K, LO L89K, LY L89K LS L896, LA L896, LO L896, LY L896 - TOPLED LS T670, LO T670, LY T670, LG T670, LP T670 LSG T670, LSP T670, LSY T670, LOP T670, LYG T670 LG T671, LOG T671, LSG T671 LB T673, LV T673, LT T673, LW T673 LH T674 LS T676, LA T676, LO T676, LY T676, LB T676, LH T676, LSB T676, LW T676 LB T67C, LV T67C, LT T67C, LS T67K, LO T67K, LY T67K, LW E67C LS E67B, LA E67B, LO E67B, LY E67B, LB E67C, LV E67C, LT E67C LW T67C LS T679, LY T679, LG T679 LS T770, LO T770, LY T770, LG T770, LP T770 LB T773, LV T773, LT T773, LW T773 LH T774 LS E675, LA E675, LY E675, LS T675 LS T776, LA T776, LO T776, LY T776, LB T776 LHGB T686 LT T68C, LB T68C - Hyper Mini TOPLED® LB M676 - Mini TOPLED Santana® LG M470 LS M47K, LO M47K, LY M47K Source: http://www.osram.convergy.de LUXEON: - LUMILED® LXK2-PW12-R00, LXK2-PW12-S00, LXK2-PW14-U00, LXK2-PW14-V00 LXK2-PM12-R00, LXK2-PM12-S00, LXK2-PM14-U00 LXK2-PE12-Q00, LXK2-PE12-R00, LXK2-PE12-S00, LXK2-PE14-T00, LXK2-PE14-U00 LXK2-PB12-K00, LXK2-PB12-L00, LXK2-PB12-M00, LXK2-PB14-N00, LXK2-PB14-P00, LXK2-PB14-Q00 LXK2-PR12-L00, LXK2-PR12-M00, LXK2-PR14-Q00, LXK2-PR14-R00 LXK2-PD12-Q00, LXK2-PD12-R00, LXK2-PD12-S00 LXK2-PH12-R00, LXK2-PH12-S00 LXK2-PL12-P00, LXK2-PL12-Q00, LXK2-PL12-R00 Source: www.luxeon.com KINGBRIGHT: KA-3528ASYC Source: www.kingbright.com
PH1 = custom:A10: Sensor Robust Light Sensing Applications Outdoor Light Sensing Application Source: http://optoelectronics.perkinelmer.com/content/Datasheets/DTS_PhotocellsA1050.pdf
Q1-Q29 = custom:BS170: N-CHANNEL MOS FET
R1-R64 = custom:R-EU_: RESISTOR, European symbol; SPICEPREFIX: R
S1 S2 = custom:DT: ITT SWITCH
U1 = custom:MSP430G2XX3
X1 = custom:CRYSTAL: CRYSTAL; OC_FARNELL: unknown; OC_NEWARK: unknown

## Net classes
0 default: width 0.61 mm, drill 0.6 mm, clearance 0.203 mm
1 power_high: width 2.54 mm, drill 0.6 mm, clearance 0.406 mm
2 power_low: width 1.219 mm, drill 0.6 mm, clearance 0.203 mm

## Board
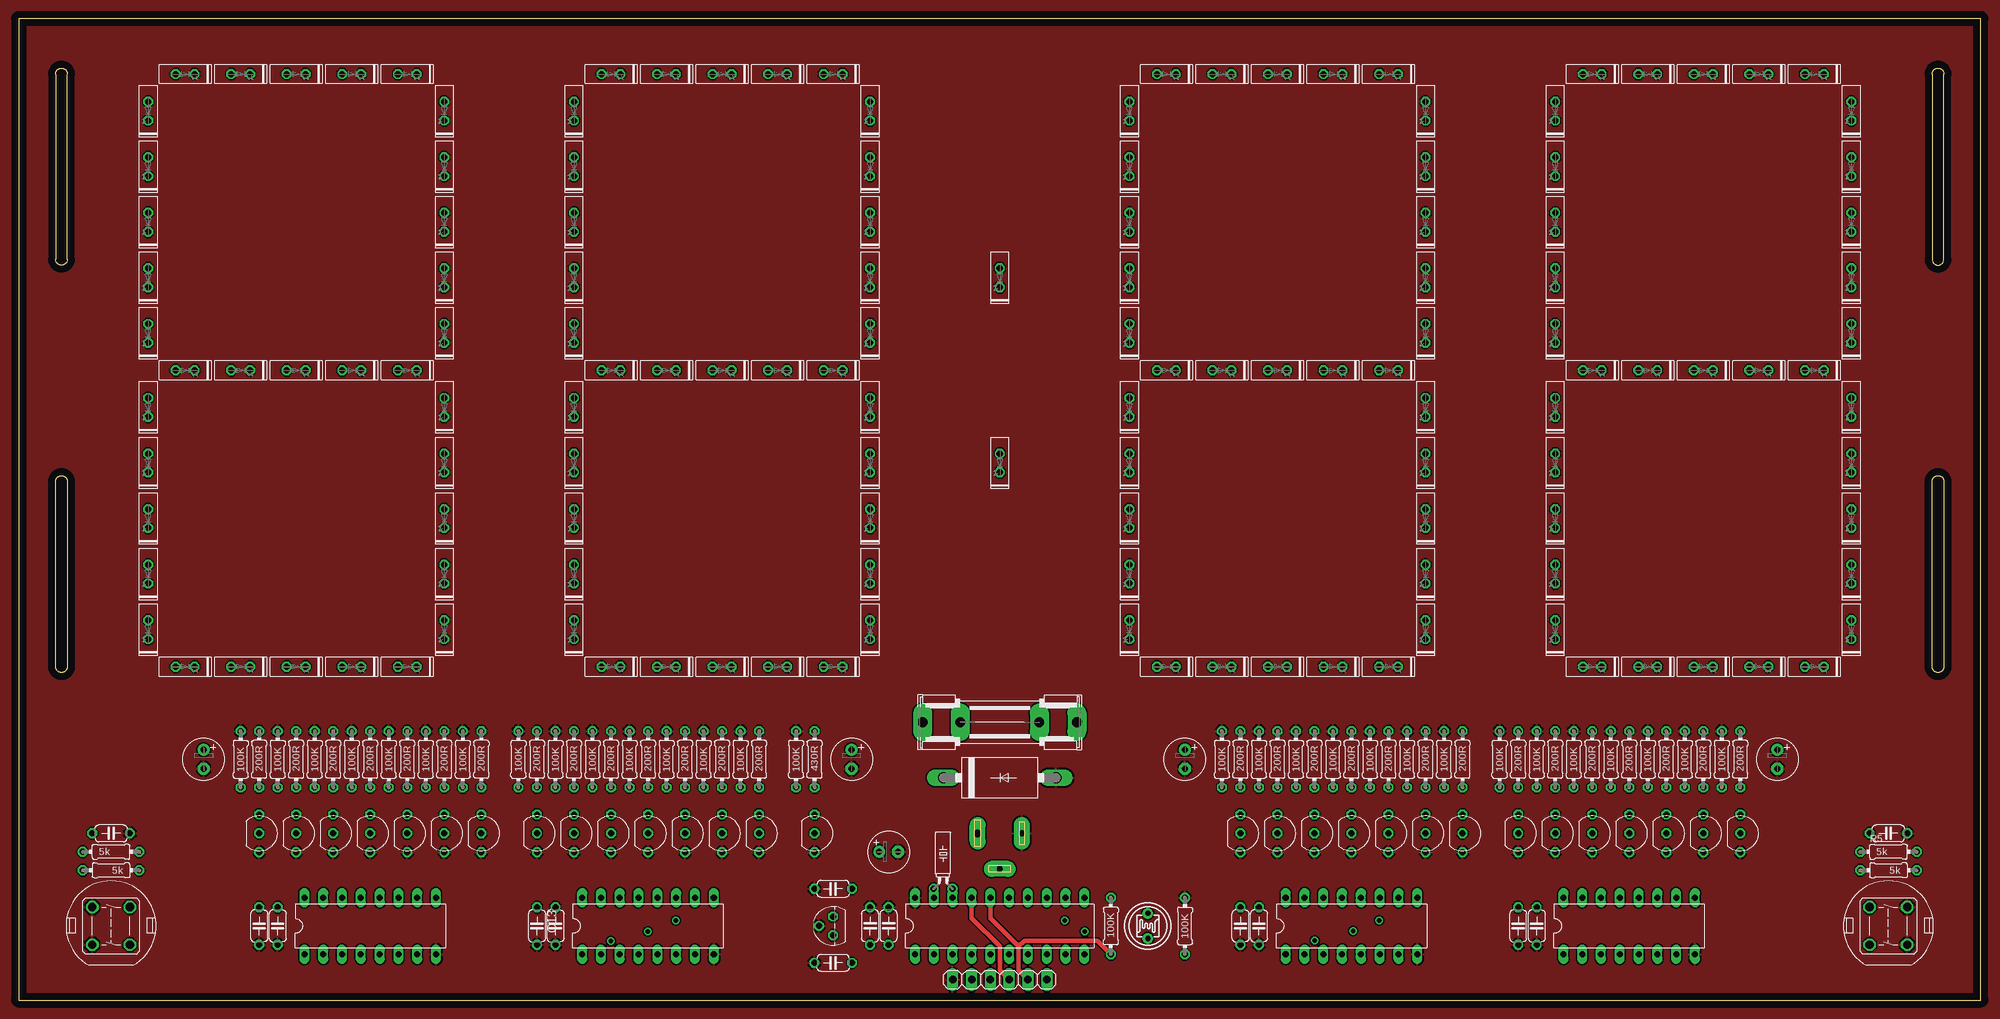
[diagram p6: board, top side]
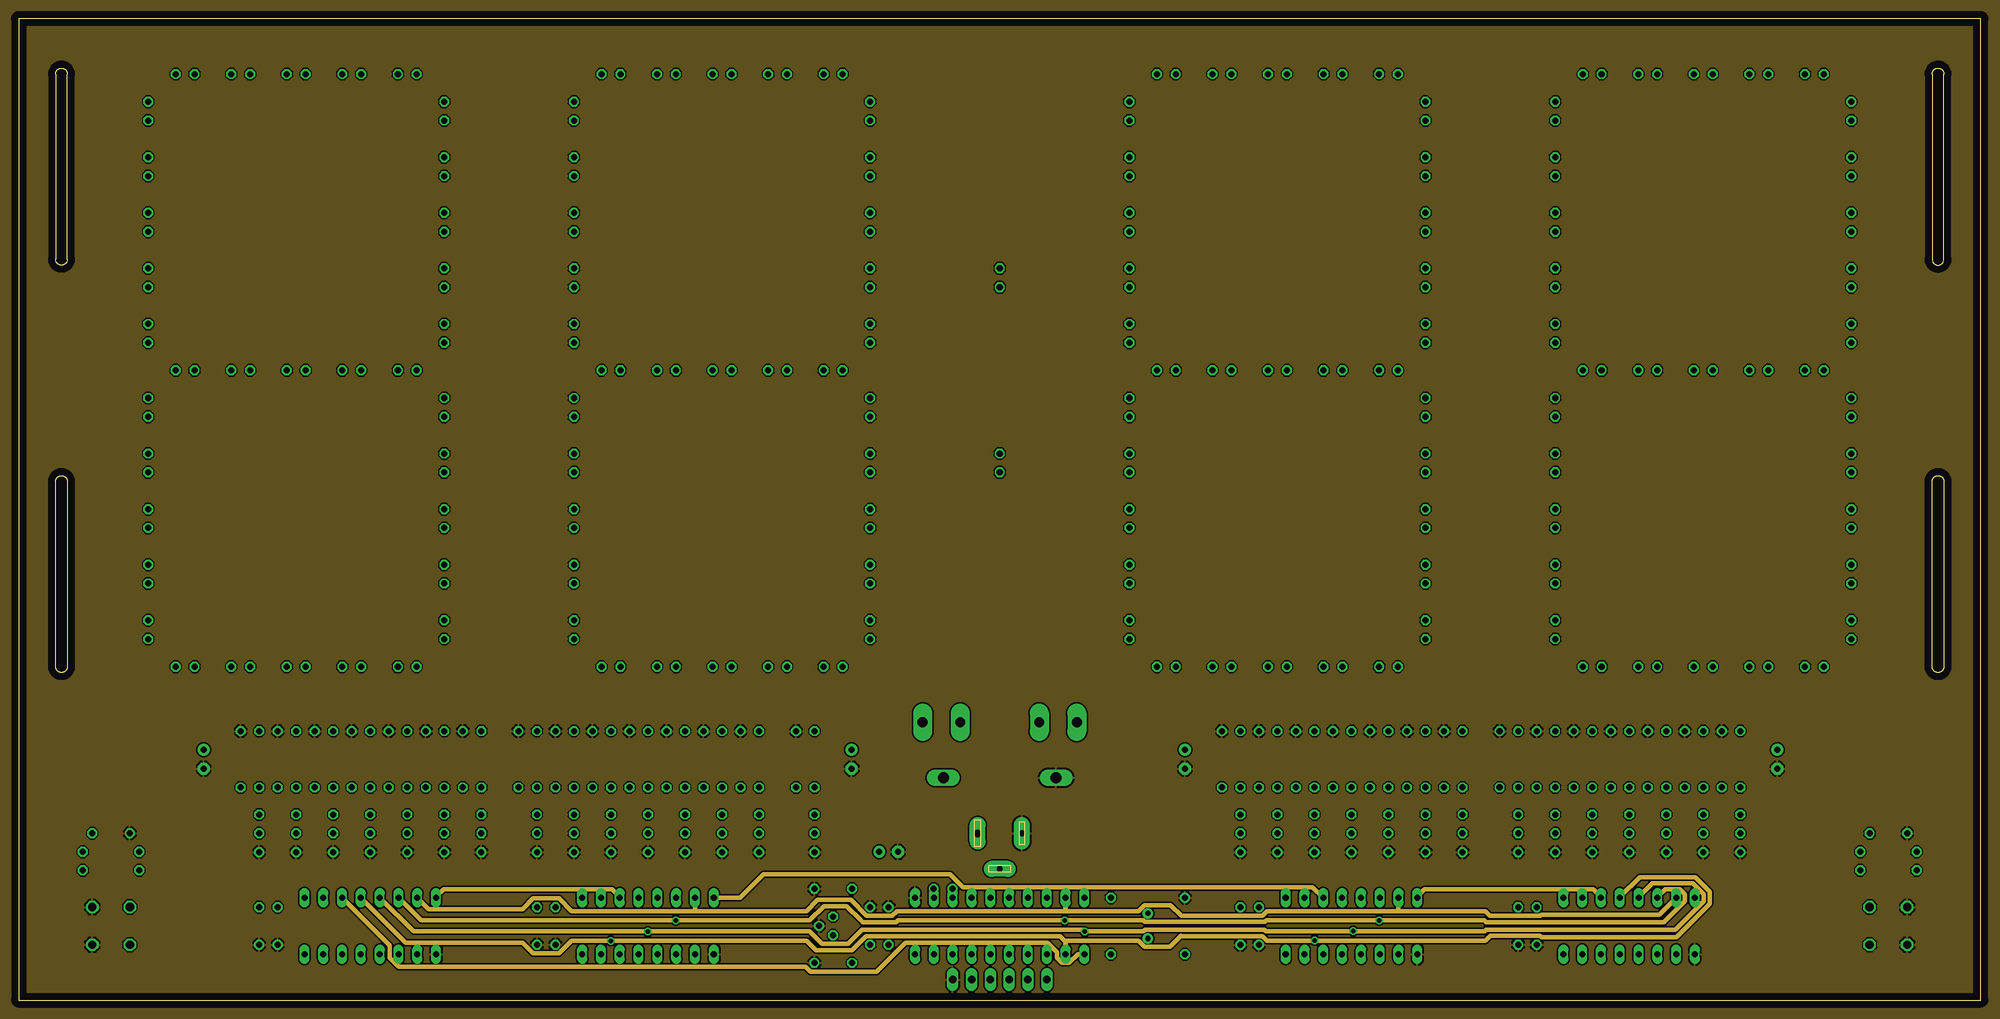
[diagram p7: board, inner layer Route2]
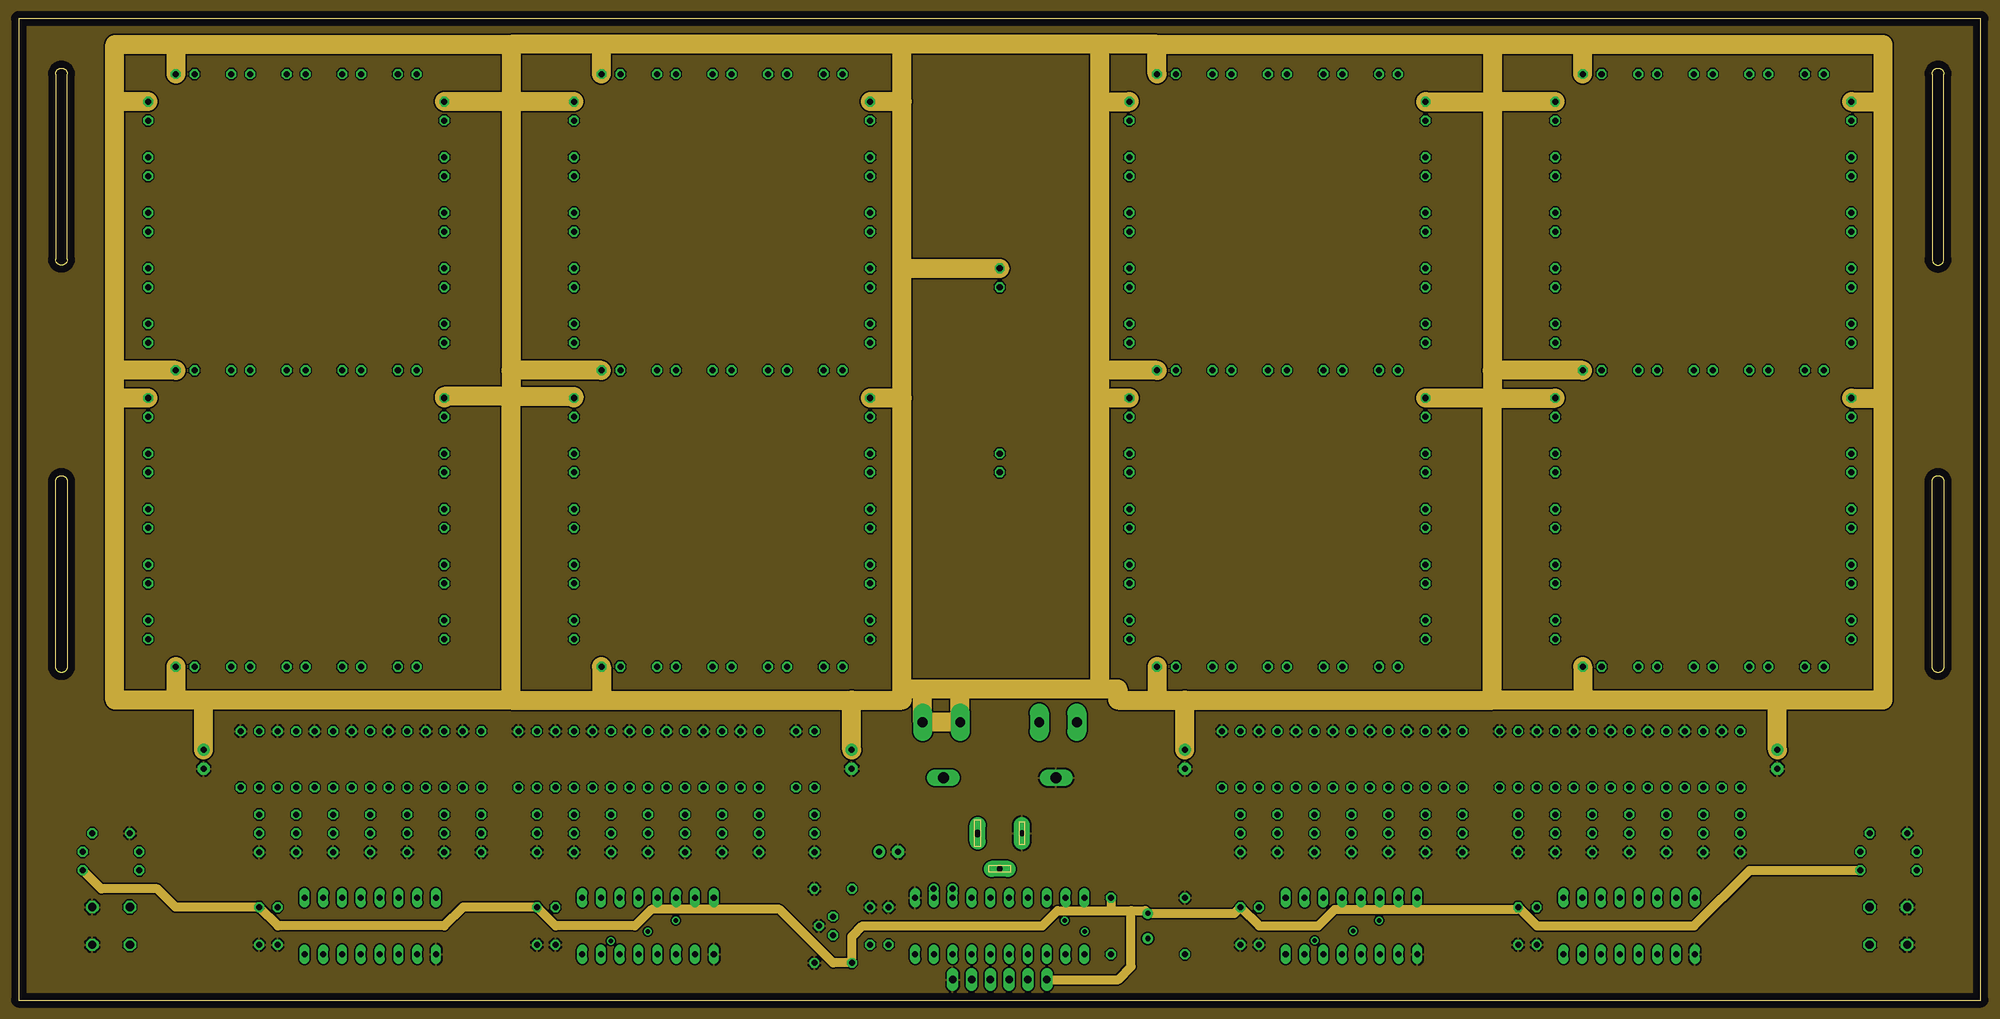
[diagram p8: board, inner layer Route15]
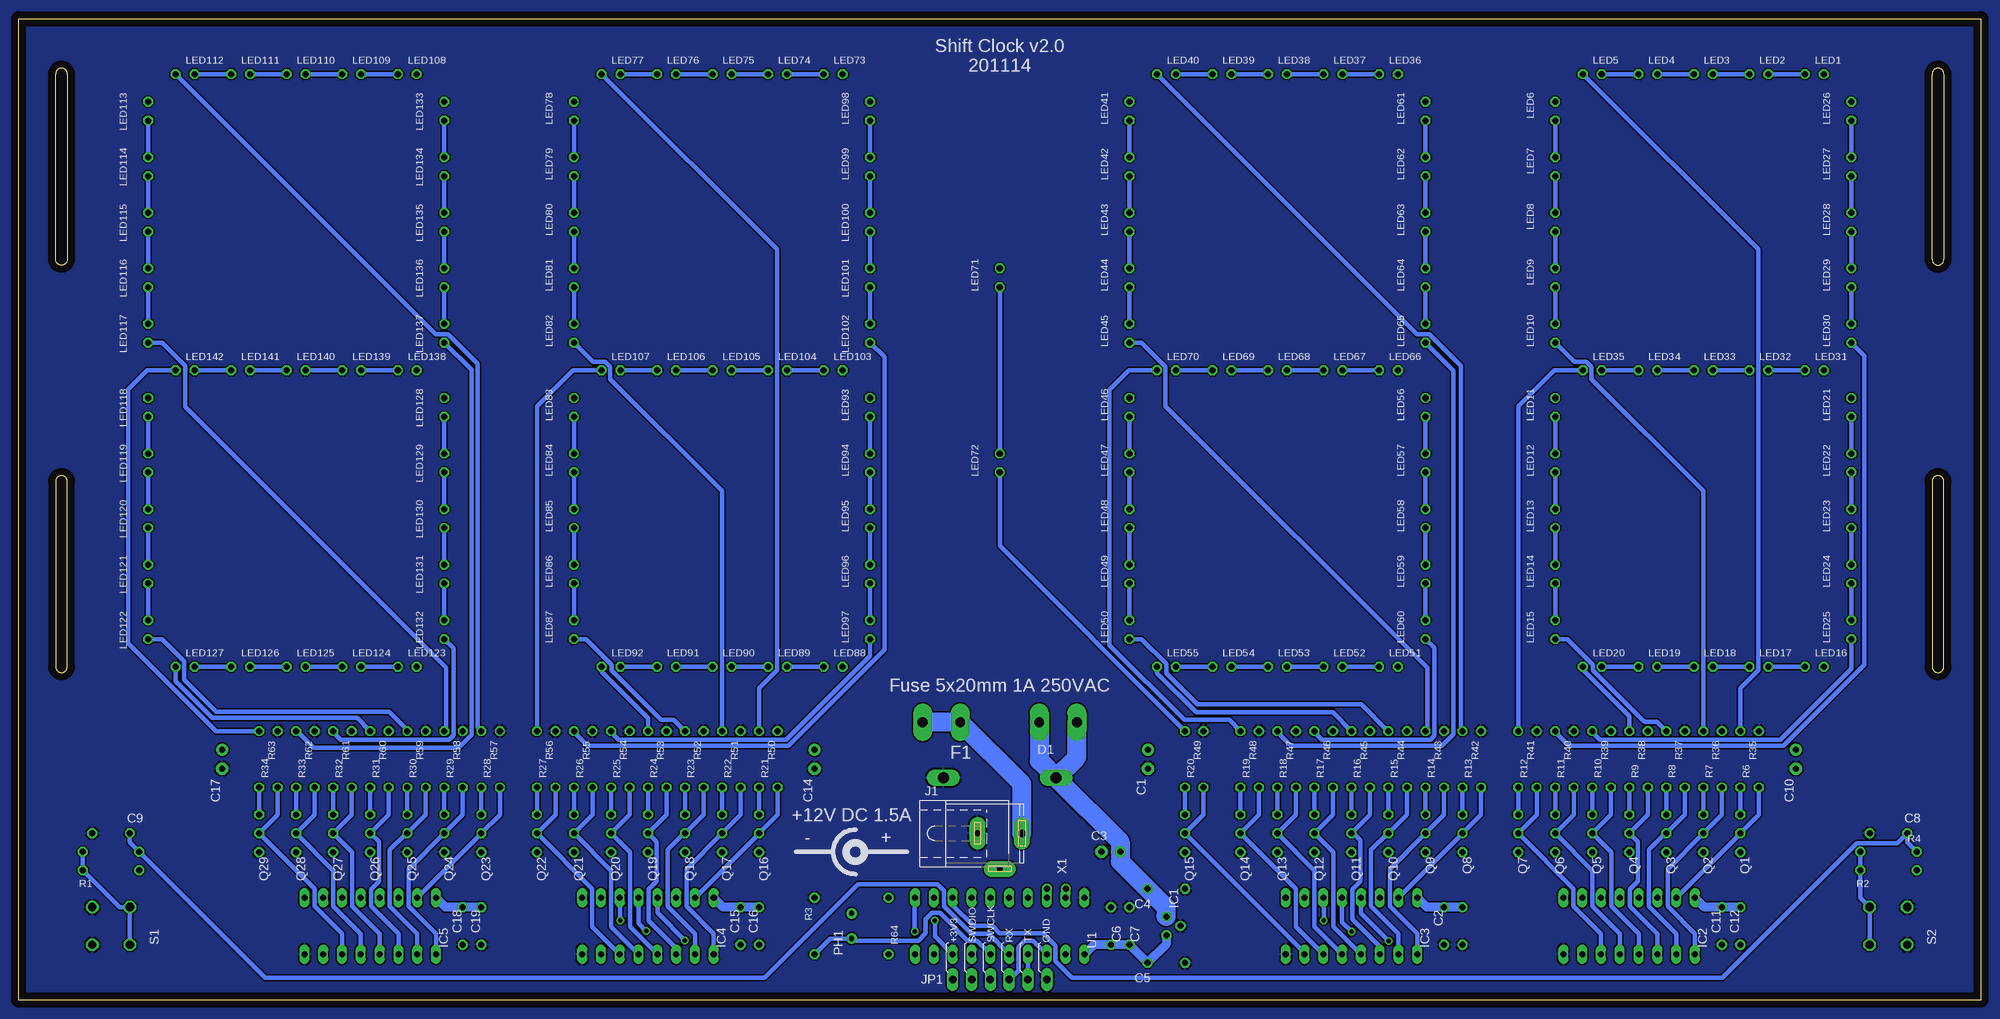
[diagram p9: board, bottom side, seen from below]

Size 265 x 132.5 mm. Coordinates in mm from the lower left corner, seen from the top.
Outline: 0,0 265,0 265,132.5 0,132.5 0,0
Outline: 5,125 5,100 arc180 6.6,100 6.6,125 arc180 5,125
Outline: 6.6,70 6.6,45 arc-180 5,45 5,70 arc-180 6.6,70
Outline: 258.4,125 258.4,100 arc180 260,100 260,125 arc180 258.4,125
Outline: 260,70 260,45 arc-180 258.4,45 258.4,70 arc-180 260,70
Copper layers (1+2*15+16): Top 0.035mm / dielectric 1.5mm / Route2 0.035mm / dielectric 0.15mm / Route15 0.035mm / dielectric 0.2mm / Bottom 0.035mm
Design rules "default *": minimum track width 6mil, minimum drill 0.35mm, track to track 6mil, track to pad 6mil, pad to pad 6mil, via to via 6mil, smd to smd 6mil, copper to edge 40mil, drill to drill 6mil, minimum pad ring 10mil, minimum via ring 8mil, stop-mask expansion 4mil, vias tented up to drill 0mil, thermal gap 10mil

### Footprints (pad centres in the part's own frame; a part is rotated, then mirrored left to right if it is on the bottom)
E2,5-6 = drill 0.813 pad 1.6: + -1.27,0 | drill 0.813 pad 1.6 octagon: - 1.27,0
C050-024X044 = drill 0.813 octagon: 1 -2.54,0; 2 2.54,0
DO201-15 = drill 1.499 long: A 7.62,0; C -7.62,0
SHK20L = drill 1.321 pad 2.54 long: 1A -10.414,0; 1B -5.334,0; 2A 10.414,0; 2B 5.334,0
TO92 = drill 0.813 octagon: 1 -1.27,0; 2 0,1.905; 3 1.27,0
DIL16 = drill 0.813 long: 1 -8.89,-3.81; 2 -6.35,-3.81; 3 -3.81,-3.81; 4 -1.27,-3.81; 5 1.27,-3.81; 6 3.81,-3.81; 7 6.35,-3.81; 8 8.89,-3.81; 9 8.89,3.81; 10 6.35,3.81; 11 3.81,3.81; 12 1.27,3.81; 13 -1.27,3.81; 14 -3.81,3.81; 15 -6.35,3.81; 16 -8.89,3.81
SPC4077 = drill 0.8 pad 2.184 long: 1 -3,0; 2 0,-4.8 | drill 1 pad 2.184 long: 3 3,0
1X06 = drill 1.016 long: 1 -6.35,0; 2 -3.81,0; 3 -1.27,0; 4 1.27,0; 5 3.81,0; 6 6.35,0
LED25X70 = drill 0.813 octagon: A -1.27,0; K 1.27,0
T0-46-A10XX = drill 0.7 pad 1.4: 1 -1.7,0; 2 1.7,0
SOT54E = drill 0.813 octagon: D -2.54,0; G 0,0; S 2.54,0
0204/7 = drill 0.813 octagon: 1 -3.81,0; 2 3.81,0
DTE6 = drill 1.118 octagon: 1 -2.54,2.54; 2 2.54,2.54; 3 2.54,-2.54; 4 -2.54,-2.54
DIL20 = drill 0.813 long: 1 -11.43,-3.81; 2 -8.89,-3.81; 3 -6.35,-3.81; 4 -3.81,-3.81; 5 -1.27,-3.81; 6 1.27,-3.81; 7 3.81,-3.81; 8 6.35,-3.81; 9 8.89,-3.81; 10 11.43,-3.81; 11 11.43,3.81; 12 8.89,3.81; 13 6.35,3.81; 14 3.81,3.81; 15 1.27,3.81; 16 -1.27,3.81; 17 -3.81,3.81; 18 -6.35,3.81; 19 -8.89,3.81; 20 -11.43,3.81
TC26H = drill 0.813: 1 -1.27,0; 2 1.27,0

### Placement (x,y rotation side)
C1  112.5,32.5 270 top
C2  72.5,10 270 top
C3  117.5,20 0 top
C4  110,15 180 top
C5  110,5 180 top
C6  117.5,10 90 top
C7  115,10 90 top
C8  12.5,22.5 0 top
C9  252.5,22.5 0 top
C10  25,32.5 270 top
C11  35,10 270 top
C12  32.5,10 270 top
C13  70,10 270 top
C14  157.5,32.5 270 top
C15  167.5,10 270 top
C16  165,10 270 top
C17  237.5,32.5 270 top
C18  205,10 270 top
C19  202.5,10 270 top
D1  132.5,30 0 top
F1  132.5,37.5 180 top
IC1  110,10 90 top
IC2  47.5,10 0 top
IC3  85,10 0 top
IC4  180,10 0 top
IC5  217.5,10 0 top
J1  132.5,22.5 0 bottom
JP1  132.5,2.75 180 top
LED1  22.5,125 0 top
LED2  30,125 0 top
LED3  37.5,125 0 top
LED4  45,125 0 top
LED5  52.5,125 0 top
LED6  57.5,120 270 top
LED7  57.5,112.5 270 top
LED8  57.5,105 270 top
LED9  57.5,97.5 270 top
LED10  57.5,90 270 top
LED11  57.5,80 270 top
LED12  57.5,72.5 270 top
LED13  57.5,65 270 top
LED14  57.5,57.5 270 top
LED15  57.5,50 270 top
LED16  22.5,45 0 top
LED17  30,45 0 top
LED18  37.5,45 0 top
LED19  45,45 0 top
LED20  52.5,45 0 top
LED21  17.5,80 270 top
LED22  17.5,72.5 270 top
LED23  17.5,65 270 top
LED24  17.5,57.5 270 top
LED25  17.5,50 270 top
LED26  17.5,120 270 top
LED27  17.5,112.5 270 top
LED28  17.5,105 270 top
LED29  17.5,97.5 270 top
LED30  17.5,90 270 top
LED31  22.5,85 0 top
LED32  30,85 0 top
LED33  37.5,85 0 top
LED34  45,85 0 top
LED35  52.5,85 0 top
LED36  80,125 0 top
LED37  87.5,125 0 top
LED38  95,125 0 top
LED39  102.5,125 0 top
LED40  110,125 0 top
LED41  115,120 270 top
LED42  115,112.5 270 top
LED43  115,105 270 top
LED44  115,97.5 270 top
LED45  115,90 270 top
LED46  115,80 270 top
LED47  115,72.5 270 top
LED48  115,65 270 top
LED49  115,57.5 270 top
LED50  115,50 270 top
LED51  80,45 0 top
LED52  87.5,45 0 top
LED53  95,45 0 top
LED54  102.5,45 0 top
LED55  110,45 0 top
LED56  75,80 270 top
LED57  75,72.5 270 top
LED58  75,65 270 top
LED59  75,57.5 270 top
LED60  75,50 270 top
LED61  75,120 270 top
LED62  75,112.5 270 top
LED63  75,105 270 top
LED64  75,97.5 270 top
LED65  75,90 270 top
LED66  80,85 0 top
LED67  87.5,85 0 top
LED68  95,85 0 top
LED69  102.5,85 0 top
LED70  110,85 0 top
LED71  132.5,97.5 270 top
LED72  132.5,72.5 270 top
LED73  155,125 0 top
LED74  162.5,125 0 top
LED75  170,125 0 top
LED76  177.5,125 0 top
LED77  185,125 0 top
LED78  190,120 270 top
LED79  190,112.5 270 top
LED80  190,105 270 top
LED81  190,97.5 270 top
LED82  190,90 270 top
LED83  190,80 270 top
LED84  190,72.5 270 top
LED85  190,65 270 top
LED86  190,57.5 270 top
LED87  190,50 270 top
LED88  155,45 0 top
LED89  162.5,45 0 top
LED90  170,45 0 top
LED91  177.5,45 0 top
LED92  185,45 0 top
LED93  150,80 270 top
LED94  150,72.5 270 top
LED95  150,65 270 top
LED96  150,57.5 270 top
LED97  150,50 270 top
LED98  150,120 270 top
LED99  150,112.5 270 top
LED100  150,105 270 top
LED101  150,97.5 270 top
LED102  150,90 270 top
LED103  155,85 0 top
LED104  162.5,85 0 top
LED105  170,85 0 top
LED106  177.5,85 0 top
LED107  185,85 0 top
LED108  212.5,125 0 top
LED109  220,125 0 top
LED110  227.5,125 0 top
LED111  235,125 0 top
LED112  242.5,125 0 top
LED113  247.5,120 270 top
LED114  247.5,112.5 270 top
LED115  247.5,105 270 top
LED116  247.5,97.5 270 top
LED117  247.5,90 270 top
LED118  247.5,80 270 top
LED119  247.5,72.5 270 top
LED120  247.5,65 270 top
LED121  247.5,57.5 270 top
LED122  247.5,50 270 top
LED123  212.5,45 0 top
LED124  220,45 0 top
LED125  227.5,45 0 top
LED126  235,45 0 top
LED127  242.5,45 0 top
LED128  207.5,80 270 top
LED129  207.5,72.5 270 top
LED130  207.5,65 270 top
LED131  207.5,57.5 270 top
LED132  207.5,50 270 top
LED133  207.5,120 270 top
LED134  207.5,112.5 270 top
LED135  207.5,105 270 top
LED136  207.5,97.5 270 top
LED137  207.5,90 270 top
LED138  212.5,85 0 top
LED139  220,85 0 top
LED140  227.5,85 0 top
LED141  235,85 0 top
LED142  242.5,85 0 top
PH1  152.5,10 270 top
Q1  32.5,22.5 270 top
Q2  37.5,22.5 270 top
Q3  42.5,22.5 270 top
Q4  47.5,22.5 270 top
Q5  52.5,22.5 270 top
Q6  57.5,22.5 270 top
Q7  62.5,22.5 270 top
Q8  70,22.5 270 top
Q9  75,22.5 270 top
Q10  80,22.5 270 top
Q11  85,22.5 270 top
Q12  90,22.5 270 top
Q13  95,22.5 270 top
Q14  100,22.5 270 top
Q15  107.5,22.5 270 top
Q16  165,22.5 270 top
Q17  170,22.5 270 top
Q18  175,22.5 270 top
Q19  180,22.5 270 top
Q20  185,22.5 270 top
Q21  190,22.5 270 top
Q22  195,22.5 270 top
Q23  202.5,22.5 270 top
Q24  207.5,22.5 270 top
Q25  212.5,22.5 270 top
Q26  217.5,22.5 270 top
Q27  222.5,22.5 270 top
Q28  227.5,22.5 270 top
Q29  232.5,22.5 270 top
R1  252.5,17.5 180 top
R2  12.5,17.5 180 top
R3  157.5,10 270 top
R4  12.5,20 0 top
R5  252.5,20 0 top
R6  32.5,32.5 90 top
R7  37.5,32.5 90 top
R8  42.5,32.5 90 top
R9  47.5,32.5 90 top
R10  52.5,32.5 90 top
R11  57.5,32.5 90 top
R12  62.5,32.5 90 top
R13  70,32.5 90 top
R14  75,32.5 90 top
R15  80,32.5 90 top
R16  85,32.5 90 top
R17  90,32.5 90 top
R18  95,32.5 90 top
R19  100,32.5 90 top
R20  107.5,32.5 90 top
R21  165,32.5 90 top
R22  170,32.5 90 top
R23  175,32.5 90 top
R24  180,32.5 90 top
R25  185,32.5 90 top
R26  190,32.5 90 top
R27  195,32.5 90 top
R28  202.5,32.5 90 top
R29  207.5,32.5 90 top
R30  212.5,32.5 90 top
R31  217.5,32.5 90 top
R32  222.5,32.5 90 top
R33  227.5,32.5 90 top
R34  232.5,32.5 90 top
R35  30,32.5 270 top
R36  35,32.5 270 top
R37  40,32.5 270 top
R38  45,32.5 270 top
R39  50,32.5 270 top
R40  55,32.5 270 top
R41  60,32.5 270 top
R42  67.5,32.5 270 top
R43  72.5,32.5 270 top
R44  77.5,32.5 270 top
R45  82.5,32.5 270 top
R46  87.5,32.5 270 top
R47  92.5,32.5 270 top
R48  97.5,32.5 270 top
R49  105,32.5 270 top
R50  162.5,32.5 270 top
R51  167.5,32.5 270 top
R52  172.5,32.5 270 top
R53  177.5,32.5 270 top
R54  182.5,32.5 270 top
R55  187.5,32.5 270 top
R56  192.5,32.5 270 top
R57  200,32.5 270 top
R58  205,32.5 270 top
R59  210,32.5 270 top
R60  215,32.5 270 top
R61  220,32.5 270 top
R62  225,32.5 270 top
R63  230,32.5 270 top
R64  147.5,10 90 top
S1  252.5,10 90 top
S2  12.5,10 90 top
U1  132.5,10 0 top
X1  124.85,15 0 top

### Tracks (layer width: path | path; a pad name or v marks a point on that pad's centre or on a via)
+3V3
  Route15 1.219: R2.2 11.19,15 18.75,15 21.21,12.54 C12.1 35.04,10 57.5,10 60.04,12.54 C13.1 72.54,10 83.25,10 85.5,12.25 102.75,12.25 110,5 C5.1 112.54,8.54 114,10 138.25,10 140.32,12.07 147.5,12.07 | 147.5,12.07 150.25,12.07 | 150.25,12.07 152.13,12.07 PH1.1 164.16,11.7 C16.1 167.54,10 175.5,10 177.75,12.25 202.21,12.25 C19.1 205.04,10 226.25,10 233.75,17.5 R1.2 | JP1.1 148.5,2.75 150.25,4.5 150.25,12.07 | R64.2 147.5,12.07
  Bottom 1.219: C12.1 C11.1 37.34,12.54 IC2.16 | C13.1 C2.1 74.84,12.54 IC3.16 | U1.1 119.8,7.46 C6.1 C7.1 C5.1 110,7.54 IC1.1 | C16.1 C15.1 169.84,12.54 IC4.16 | C19.1 C18.1 207.34,12.54 IC5.16
+12V
  Route15 2.54: 122.09,42 F1.2A F1.2B 127.17,42 | 119.34,42 119.34,81.27 | 119.34,81.27 LED46.A | 119.34,81.27 119.34,98.75 | 119.34,98.75 119.34,121.27 | 119.34,121.27 LED41.A | 119.34,121.27 119.34,129 | 21.23,129 LED1.A | 119.34,129 78.73,129 | 78.73,129 66.5,129 | 21.23,129 66.5,129 | LED36.A 78.73,129 | 66.5,40.5 78.75,40.5 | 78.75,40.5 112.5,40.5 | 66.5,129 66.5,121.27 | 66.5,121.27 66.5,85 | 66.5,85 66.5,81.5 | 66.5,40.5 66.5,81.5 | 66.5,40.5 25,40.5 | 25,40.5 21.25,40.5 | 21.25,40.5 13,40.5 13,81.27 | 21.23,129 13,129 13,121.27 | 13,81.27 13,85 | 13,85 13,121.27 | 66.5,81.5 57.5,81.5 LED11.A | 66.5,81.5 75,81.5 LED56.A | LED66.A 66.5,85 | LED61.A 66.5,121.27 | 66.5,121.27 LED6.A | LED26.A 13,121.27 | LED31.A 13,85 | LED21.A 13,81.27 | 119.34,42 122.09,42 | 122.09,42 127.17,42 | 127.17,42 146,42 | 146,42 148.46,42 148.46,40.5 153.73,40.5 | 153.73,129 199,129 | 153.73,129 146,129 | 146,129 119.34,129 | 153.73,40.5 157.5,40.5 | 157.5,40.5 199,40.5 | 199,40.5 199,81.25 | 199,129 199,121.25 | 199,121.25 199,85 | 199,85 199,81.25 | 146,121.27 LED98.A | 146,42 146,81.27 | 146,81.27 146,85 | 146,85 146,121.27 | 146,121.27 146,129 | LED73.A 153.73,129 | LED103.A 146,85 | LED93.A 146,81.27 | LED88.A 153.73,40.5 | 199,81.25 190,81.25 LED83.A | 199,81.25 207.5,81.25 LED128.A | LED138.A 199,85 | 237.5,40.5 251.75,40.5 251.75,81.27 | 237.5,40.5 211.23,40.5 | 211.23,40.5 199,40.5 | 251.75,121.27 251.75,129 211,129 | 251.75,121.27 251.75,81.27 | LED123.A 211.23,40.5 | LED118.A 251.75,81.27 | LED113.A 251.75,121.27 | LED71.A 132.5,98.75 119.34,98.75 | 199,129 211,129 | C10.+ 25,40.5 | C1.+ 112.5,40.5 | C14.+ 157.5,40.5 | C17.+ 237.5,40.5 | LED51.A 78.73,40.52 78.75,40.5 | LED16.A 21.23,40.52 21.25,40.5 | LED78.A 190.02,121.25 199,121.25
  Route15 2.54: LED133.A 199.02,121.27 199,121.25 | LED108.A 211.23,128.77 211,129 | 112.5,40.5 119.34,40.5 119.34,42
  Bottom 2.54: D1.C 122.09,32.79 F1.2A | F1.2B 127.17,32.29 D1.C | D1.C 116.23,21.35 C3.+ 116.23,18.69 C4.1 110.06,12.53 | 110.06,12.53 110.06,11.34 | IC1.3 110,12.46 110.06,12.53
CLR
  Route2 0.61: 141.5,12 151.23,12 152.04,12.81 155.58,12.81 157.02,11.37 167.98,11.37 168.61,12 186.35,12 | IC2.10 55.41,12.25 68.06,12.25 69.52,13.71 72.98,13.71 74.69,12 91.35,12 | 91.35,12 106.43,12 107.93,13.5 112.39,13.5 114.52,11.37 117.98,11.37 118.61,12 141.5,12 | IC5.10 221.54,11.5 205.61,11.5 205.48,11.37 198.7,11.37 198.07,12 186.35,12 | IC3.10 91.35,12 | IC4.10 186.35,12 | 141.5,12 141.39,12.11 U1.12
DIGIT1_OUT
  Route2 0.61: IC3.14 81.19,13.92 80.13,14.98 57.39,14.98 56.39,13.98 IC2.9
DIGIT2_OUT
  Route2 0.61: IC3.9 97.44,13.81 100.61,16.98 125.79,16.98 127.52,15.25 174.75,15.25 IC4.14
DIGIT3_OUT
  Route2 0.61: IC5.14 213.69,13.92 212.63,14.98 189.86,14.98 188.89,14.01 IC4.9
ENABLE  (via drill 0.6)
  Route2 0.61: IC2.13 52.29,7.75 68.06,7.75 69.52,6.29 72.98,6.29 74.69,8 80,8 | IC5.13 216.23,13.92 218.91,16.6 226.4,16.6 228.37,14.63 228.37,12.99 223.88,8.5 205.61,8.5 205.43,8.68 198.75,8.68 198.09,8.02 v175,8.02 168.59,8.02 167.98,8.63 157.02,8.63 156.96,8.69 155.46,7.19 152.04,7.19 151.23,8 141.5,8 141.39,7.89 | 80,8 v80,7.97 | 80,8 106.43,8 107.68,6.75 112.57,6.75 114.45,8.63 140.65,8.63 141.39,7.89 | U1.9 141.39,7.89
  Bottom 0.61: v80,7.97 83.73,11.7 IC3.13 | v175,8.02 178.73,11.75 IC4.13
GND
  pour Top: -2.5,135 -2.5,-2.5 267.5,-2.5 267.5,135
  pour Route2: -5,137.5 -5,-5 270,-5 270,137.5
  pour Route15: -7.5,140 -7.5,-7.5 272.5,-7.5 272.5,140
  pour Bottom: -10,142.5 -10,-10 275,-10 275,142.5
LIGHT
  Bottom 0.61: R3.2 155.39,8.3 PH1.2 152.22,8.02 143.48,8.02 142.51,8.99 142.51,10.92 141.67,11.76 140.58,11.76 136.84,8.02 135.58,8.02 133.77,6.21 U1.6
N$1
  Bottom 2.54: J1.3 129.5,29.17 F1.1B F1.1A
N$2
  Bottom 0.61: LED1.K LED2.A
N$3
  Bottom 0.61: R4.2 R2.1 16.31,13.81 S2.3 S2.4
N$4
  Bottom 0.61: S1.1 S1.2 251.35,12.54 R1.1 R5.2
N$5
  Bottom 0.61: LED2.K LED3.A
N$6
  Bottom 0.61: LED3.K LED4.A
N$7
  Bottom 0.61: LED4.K LED5.A
N$8
  Bottom 0.61: LED6.K LED7.A
N$9
  Bottom 0.61: LED8.A LED7.K
N$10
  Bottom 0.61: LED9.A LED8.K
N$11
  Bottom 0.61: LED10.A LED9.K
N$12
  Bottom 0.61: LED27.A LED26.K
N$13
  Bottom 0.61: LED28.A LED27.K
N$14
  Bottom 0.61: LED28.K LED29.A
N$15
  Bottom 0.61: LED30.A LED29.K
N$16
  Bottom 0.61: LED31.K LED32.A
N$17
  Bottom 0.61: LED32.K LED33.A
N$18
  Bottom 0.61: LED33.K LED34.A
N$19
  Bottom 0.61: LED34.K LED35.A
N$20
  Bottom 0.61: LED21.K LED22.A
N$21
  Bottom 0.61: LED23.A LED22.K
N$22
  Bottom 0.61: LED23.K LED24.A
N$23
  Bottom 0.61: LED24.K LED25.A
N$24
  Bottom 0.61: LED11.K LED12.A
N$25
  Bottom 0.61: LED12.K LED13.A
N$26
  Bottom 0.61: LED13.K LED14.A
N$27
  Bottom 0.61: LED15.A LED14.K
N$28
  Bottom 0.61: LED16.K LED17.A
N$29
  Bottom 0.61: LED17.K LED18.A
N$30
  Bottom 0.61: LED18.K LED19.A
N$31
  Bottom 0.61: LED19.K LED20.A
N$32
  Bottom 0.61: IC2.15 32.5,22.46 Q1.G 30,25 R35.2
N$33
  Bottom 0.61: IC2.1 38.61,8.96 42.32,12.67 42.32,17.68 Q2.G 35,25 R36.2
N$34
  Bottom 0.61: IC2.2 41.15,8.96 44.86,12.67 44.86,20.25 42.61,22.5 Q3.G 40,25 R37.2
N$35
  Bottom 0.61: IC2.3 43.69,8.96 47.4,12.67 47.4,14.95 46.33,16.02 46.33,21.33 Q4.G 45,25 R38.2
N$36
  Bottom 0.61: IC2.4 46.23,8.96 49.94,12.67 49.94,19.94 Q5.G 50,25 R39.2
N$37
  Bottom 0.61: IC2.5 48.77,8.96 52.48,12.67 52.48,17.48 Q6.G 55,25 R40.2
N$38
  Bottom 0.61: IC2.6 51.31,8.96 55.02,12.67 55.02,15.02 Q7.G 60,25 R41.2
N$39
  Bottom 0.61: R6.1 Q1.D
N$40
  Bottom 0.61: R7.1 Q2.D
N$41
  Bottom 0.61: R8.1 Q3.D
N$42
  Bottom 0.61: R9.1 Q4.D
N$43
  Bottom 0.61: R10.1 Q5.D
N$44
  Bottom 0.61: R11.1 Q6.D
N$45
  Bottom 0.61: R12.1 Q7.D
N$46
  Bottom 0.61: R6.2 32.5,42.12 30.1,44.52 30.1,101.33 LED5.K
N$47
  Bottom 0.61: R7.2 37.5,68.73 52.6,83.83 52.6,85.48 53.29,86.17 54.94,86.17 LED10.K
N$48
  Bottom 0.61: R8.2 43.77,37.58 45.46,37.58 52.4,44.52 52.4,45.28 55.85,48.73 LED15.K
N$49
  Bottom 0.61: R9.2 47.5,38.31 53.77,44.58 LED20.K
N$50
  Bottom 0.61: R10.2 52.5,36.16 51.48,35.14 27.11,35.14 17.5,44.75 LED25.K
N$51
  Bottom 0.61: R11.2 57.5,36.16 55.67,34.33 26.67,34.33 15.75,45.25 15.75,86.98 LED30.K
N$52
  Bottom 0.61: LED35.K 57.63,85 62.5,80.13 R12.2
N$53
  Bottom 0.61: LED36.K LED37.A
N$54
  Bottom 0.61: LED37.K LED38.A
N$55
  Bottom 0.61: LED38.K LED39.A
N$56
  Bottom 0.61: LED39.K LED40.A
N$57
  Bottom 0.61: LED41.K LED42.A
N$58
  Bottom 0.61: LED42.K LED43.A
N$59
  Bottom 0.61: LED43.K LED44.A
N$60
  Bottom 0.61: LED44.K LED45.A
N$61
  Bottom 0.61: LED61.K LED62.A
N$62
  Bottom 0.61: LED62.K LED63.A
N$63
  Bottom 0.61: LED63.K LED64.A
N$64
  Bottom 0.61: LED64.K LED65.A
N$65
  Bottom 0.61: LED66.K LED67.A
N$66
  Bottom 0.61: LED67.K LED68.A
N$67
  Bottom 0.61: LED68.K LED69.A
N$68
  Bottom 0.61: LED69.K LED70.A
N$69
  Bottom 0.61: LED56.K LED57.A
N$70
  Bottom 0.61: LED57.K LED58.A
N$71
  Bottom 0.61: LED58.K LED59.A
N$72
  Bottom 0.61: LED59.K LED60.A
N$73
  Bottom 0.61: LED47.A LED46.K
N$74
  Bottom 0.61: LED48.A LED47.K
N$75
  Bottom 0.61: LED49.A LED48.K
N$76
  Bottom 0.61: LED50.A LED49.K
N$77
  Bottom 0.61: LED51.K LED52.A
N$78
  Bottom 0.61: LED52.K LED53.A
N$79
  Bottom 0.61: LED53.K LED54.A
N$80
  Bottom 0.61: LED54.K LED55.A
N$81
  Bottom 0.61: R42.2 67.5,25 Q8.G 70,22.46 IC3.15
N$82
  Bottom 0.61: R43.2 72.5,25 Q9.G 79.82,17.68 79.82,12.67 76.11,8.96 IC3.1
N$83
  Bottom 0.61: R44.2 77.5,25 Q10.G 80.11,22.5 82.36,20.25 82.36,12.67 78.65,8.96 IC3.2
N$84
  Bottom 0.61: R45.2 82.5,25 84.88,22.62 | 84.88,22.62 Q11.G | IC3.3 81.19,7.21 84.9,10.92 84.9,14.95 83.83,16.02 83.83,21.58 84.88,22.62
N$85
  Bottom 0.61: R46.2 87.5,25 Q12.G 87.44,19.94 87.44,9.92 83.73,6.21 IC3.4
N$86
  Bottom 0.61: R47.2 92.5,25 Q13.G 89.98,17.48 89.98,9.92 86.27,6.21 IC3.5
N$87
  Bottom 0.61: R48.2 97.5,25 Q14.G 92.52,15.02 92.52,9.92 88.81,6.21 IC3.6
N$88
  Bottom 0.61: R13.1 Q8.D
N$89
  Bottom 0.61: R14.1 Q9.D
N$90
  Bottom 0.61: R15.1 Q10.D
N$91
  Bottom 0.61: R16.1 Q11.D
N$92
  Bottom 0.61: R17.1 Q12.D
N$93
  Bottom 0.61: R18.1 Q13.D
N$94
  Bottom 0.61: R19.1 Q14.D
N$95
  Bottom 0.61: LED40.K 76.17,89.9 74.52,89.9 70.25,85.63 70.25,36.56 R13.2
N$96
  Bottom 0.61: R14.2 74.75,36.56 74.75,44.83 110.1,80.18 110.1,85.48 113.35,88.73 LED45.K
N$97
  Bottom 0.61: LED50.K 113.35,48.73 110,45.38 110,44.12 105.78,39.89 83.64,39.89 80.06,36.31 R15.2
N$98
  Bottom 0.61: LED55.K 111.27,44.14 105.96,38.83 87.52,38.83 R16.2
N$99
  Bottom 0.61: R17.2 90,36.16 88.98,35.14 74.36,35.14 73.83,35.67 73.83,47.56 LED60.K
N$100
  Bottom 0.61: R18.2 95,36.16 93.17,34.33 72.83,34.33 71.25,35.91 71.25,84.98 LED65.K
N$101
  Bottom 0.61: R19.2 101.5,37.81 107.56,37.81 117.67,47.92 117.67,82.35 115.02,85 LED70.K
N$102
  Bottom 0.61: LED71.K LED72.A
N$103
  Bottom 0.61: R20.2 132.5,61.31 LED72.K
N$104
  Bottom 0.61: R20.1 Q15.D
N$105
  Bottom 0.61: R49.2 105,25 Q15.G 91.35,6.35 IC3.7
N$106
  Bottom 0.61: LED73.K LED74.A
N$107
  Bottom 0.61: LED74.K LED75.A
N$108
  Bottom 0.61: LED75.K LED76.A
N$109
  Bottom 0.61: LED76.K LED77.A
N$110
  Bottom 0.61: LED78.K LED79.A
N$111
  Bottom 0.61: LED79.K LED80.A
N$112
  Bottom 0.61: LED80.K LED81.A
N$113
  Bottom 0.61: LED81.K LED82.A
N$114
  Bottom 0.61: LED99.A LED98.K
N$115
  Bottom 0.61: LED100.A LED99.K
N$116
  Bottom 0.61: LED101.A LED100.K
N$117
  Bottom 0.61: LED102.A LED101.K
N$118
  Bottom 0.61: LED103.K LED104.A
N$119
  Bottom 0.61: LED104.K LED105.A
N$120
  Bottom 0.61: LED105.K LED106.A
N$121
  Bottom 0.61: LED106.K LED107.A
N$122
  Bottom 0.61: LED93.K LED94.A
N$123
  Bottom 0.61: LED94.K LED95.A
N$124
  Bottom 0.61: LED96.A LED95.K
N$125
  Bottom 0.61: LED97.A LED96.K
N$126
  Bottom 0.61: LED84.A LED83.K
N$127
  Bottom 0.61: LED85.A LED84.K
N$128
  Bottom 0.61: LED86.A LED85.K
N$129
  Bottom 0.61: LED87.A LED86.K
N$130
  Bottom 0.61: LED88.K LED89.A
N$131
  Bottom 0.61: LED89.K LED90.A
N$132
  Bottom 0.61: LED90.K LED91.A
N$133
  Bottom 0.61: LED91.K LED92.A
N$134
  Bottom 0.61: R50.2 162.5,25 Q16.G 165,22.46 IC4.15
N$135
  Bottom 0.61: R51.2 167.5,25 Q17.G 174.82,17.68 174.82,12.67 171.11,8.96 IC4.1
N$136
  Bottom 0.61: R52.2 172.5,25 Q18.G 175.11,22.5 177.36,20.25 177.36,12.67 173.65,8.96 IC4.2
N$137
  Bottom 0.61: R53.2 177.5,25 Q19.G 178.83,21.33 178.83,16.02 179.9,14.95 179.9,10.67 176.19,6.96 IC4.3
N$138
  Bottom 0.61: R54.2 182.5,25 Q20.G 182.44,19.94 182.44,9.92 178.73,6.21 IC4.4
N$140
  Bottom 0.61: R56.2 192.5,25 Q22.G 187.52,15.02 187.52,9.92 183.81,6.21 IC4.6
N$141
  Bottom 0.61: R21.1 Q16.D
N$142
  Bottom 0.61: R22.1 Q17.D
N$143
  Bottom 0.61: R23.1 Q18.D
N$144
  Bottom 0.61: R24.1 Q19.D
N$145
  Bottom 0.61: R25.1 Q20.D
N$146
  Bottom 0.61: R26.1 Q21.D
N$147
  Bottom 0.61: R27.1 Q22.D
N$148
  Bottom 0.61: R21.2 165,42.12 162.6,44.52 162.6,101.33 LED77.K
N$149
  Bottom 0.61: R22.2 170,68.73 185.1,83.83 185.1,85.48 185.79,86.17 187.44,86.17 LED82.K
N$150
  Bottom 0.61: R23.2 176.52,37.83 178.21,37.83 184.9,44.52 184.9,45.28 188.35,48.73 LED87.K
N$151
  Bottom 0.61: R24.2 180,38.06 186.27,44.33 LED92.K
N$152
  Bottom 0.61: R25.2 185,36.16 183.98,35.14 161.36,35.14 150,46.5 LED97.K
N$153
  Bottom 0.61: R26.2 190,36.16 188.17,34.33 161.02,34.33 148.08,47.27 148.08,86.81 LED102.K
N$154
  Bottom 0.61: R27.2 195,80.13 190.13,85 LED107.K
N$155
  Bottom 0.61: LED108.K LED109.A
N$156
  Bottom 0.61: LED109.K LED110.A
N$157
  Bottom 0.61: LED110.K LED111.A
N$158
  Bottom 0.61: LED111.K LED112.A
N$159
  Bottom 0.61: LED113.K LED114.A
N$160
  Bottom 0.61: LED114.K LED115.A
N$161
  Bottom 0.61: LED115.K LED116.A
N$162
  Bottom 0.61: LED116.K LED117.A
N$163
  Bottom 0.61: LED134.A LED133.K
N$164
  Bottom 0.61: LED135.A LED134.K
N$165
  Bottom 0.61: LED136.A LED135.K
N$166
  Bottom 0.61: LED137.A LED136.K
N$167
  Bottom 0.61: LED138.K LED139.A
N$168
  Bottom 0.61: LED139.K LED140.A
N$169
  Bottom 0.61: LED140.K LED141.A
N$170
  Bottom 0.61: LED141.K LED142.A
N$171
  Bottom 0.61: LED129.A LED128.K
N$172
  Bottom 0.61: LED130.A LED129.K
N$173
  Bottom 0.61: LED131.A LED130.K
N$174
  Bottom 0.61: LED132.A LED131.K
N$175
  Bottom 0.61: LED118.K LED119.A
N$176
  Bottom 0.61: LED119.K LED120.A
N$177
  Bottom 0.61: LED120.K LED121.A
N$178
  Bottom 0.61: LED121.K LED122.A
N$179
  Bottom 0.61: LED123.K LED124.A
N$180
  Bottom 0.61: LED124.K LED125.A
N$181
  Bottom 0.61: LED125.K LED126.A
N$182
  Bottom 0.61: LED126.K LED127.A
N$183
  Bottom 0.61: R57.2 200,25 Q23.G 202.5,22.46 IC5.15
N$184
  Bottom 0.61: R58.2 205,25 Q24.G 212.32,17.68 212.32,12.67 208.61,8.96 IC5.1
N$185
  Bottom 0.61: R59.2 210,25 Q25.G 212.61,22.5 214.86,20.25 214.86,12.67 211.15,8.96 IC5.2
N$186
  Bottom 0.61: R60.2 215,25 Q26.G 216.33,21.33 216.33,16.02 217.4,14.95 217.4,12.67 213.69,8.96 IC5.3
N$187
  Bottom 0.61: R61.2 220,25 Q27.G 219.94,19.94 219.94,12.67 216.23,8.96 IC5.4
N$188
  Bottom 0.61: R62.2 225,25 Q28.G 222.48,17.48 222.48,12.67 218.77,8.96 IC5.5
N$189
  Bottom 0.61: R63.2 230,25 Q29.G 225.02,15.02 225.02,12.67 221.31,8.96 IC5.6
N$190
  Bottom 0.61: R28.1 Q23.D
N$191
  Bottom 0.61: R29.1 Q24.D
N$192
  Bottom 0.61: R30.1 Q25.D
N$193
  Bottom 0.61: R31.1 Q26.D
N$194
  Bottom 0.61: R32.1 Q27.D
N$195
  Bottom 0.61: R33.1 Q28.D
N$196
  Bottom 0.61: R34.1 Q29.D
N$197
  Bottom 0.61: LED112.K 208.67,89.9 207.02,89.9 203,85.88 203,36.81 R28.2
N$198
  Bottom 0.61: R29.2 207.25,36.56 207.25,44.83 242.5,80.08 242.5,85.63 245.6,88.73 LED117.K
N$199
  Bottom 0.61: LED122.K 245.6,48.73 242.6,45.73 242.6,43.22 238.28,38.89 214.93,38.89 212.5,36.46 R30.2
N$200
  Bottom 0.61: R31.2 219.27,38.08 238.85,38.08 243.77,43 LED127.K
N$201
  Bottom 0.61: R32.2 222.5,36.16 221.48,35.14 206.86,35.14 206.25,35.75 206.25,47.48 LED132.K
N$202
  Bottom 0.61: R33.2 227.4,36.31 225.17,34.08 205.58,34.08 203.83,35.83 203.83,85.06 LED137.K
N$203
  Bottom 0.61: R34.2 238.31,36.31 250.17,48.17 250.17,82.46 247.63,85 LED142.K
N$204
  Bottom 0.61: R55.2 187.5,25 Q21.G 184.98,17.48 184.98,9.92 181.27,6.21 IC4.5
RCK  (via drill 0.6)
  Route2 0.61: IC2.12 53.33,9.25 v85,9.25 106.83,9.25 108.52,7.56 111.98,7.56 113.92,9.5 143.75,9.5 v144,9.25 151.88,9.25 152.13,9.5 168.26,9.5 168.45,9.31 v180.25,9.31 197.99,9.31 198.17,9.5 223.73,9.5 227.56,13.33 227.56,14.29 226.06,15.79 220.64,15.79 218.77,13.92 IC5.12
  Bottom 0.61: v85,9.25 86.27,10.52 IC3.12 | v144,9.25 144,13.74 U1.11 | v180.25,9.31 181.27,10.33 IC4.12
RX
  Bottom 0.61: JP1.4 130,3.98 130,7.19 129.17,8.02 127.98,8.02 U1.3
SCK  (via drill 0.6)
  Route2 0.61: v88.75,10.75 54.37,10.75 IC2.11 | v88.75,10.75 106.83,10.75 108.77,12.69 111.8,12.69 113.74,10.75 113.75,10.75 114,10.5 118.5,10.5 118.75,10.75 v141.25,10.75 151.88,10.75 152.07,10.56 168.32,10.56 168.51,10.75 v183.75,10.75 197.92,10.75 198.17,10.5 222.19,10.5 225.02,13.33 225.02,14.29 224.33,14.98 222.37,14.98 221.31,13.92 IC5.11 | v88.75,10.75 v88.75,10.76
  Bottom 0.61: v88.75,10.76 88.75,13.75 IC3.11 | v183.75,10.75 183.75,13.75 IC4.11 | v141.25,10.75 141.25,8.59 U1.8
SER
  Route2 0.61: IC2.14 50.14,7.36 50.14,5.71 51.35,4.5 106.31,4.5 106.98,3.83 115.83,3.83 119.75,7.75 138.94,7.75 140.22,6.47 140.22,5.71 140.91,5.02 141.87,5.02 143.04,6.19 U1.10
SW1
  Bottom 0.61: C9.1 249.96,21.27 R5.1 231.69,3 164.25,3 151.61,15.64 140.91,15.64 140.02,14.75 140.02,12.67 136.29,8.94 133.98,8.94 U1.5
SW2
  Bottom 0.61: R4.1 9.96,21.27 C8.1 11.29,21.17 16.79,21.17 34.96,3 122.73,3 124.98,5.25 124.98,7.33 126.67,9.02 132.52,9.02 133.5,10 136.04,10 138.85,12.81 U1.13
SWCLK
  Top 0.61: JP1.3 132.5,4.02 132.5,7.23 128.69,11.04 U1.17
SWDIO
  Top 0.61: JP1.2 135.04,4.02 135.04,7.23 | U1.16 131.23,11.04 135.04,7.23 | 135.04,7.23 135.83,8.02 145.67,8.02 R64.1
TX
  Bottom 0.61: JP1.5 U1.4
XIN
  Bottom 0.61: X1.2 126.12,13.84 U1.18
XOUT
  Bottom 0.61: X1.1 123.58,13.84 U1.19

### Text on the board
bPlace: Shift Clock v2.0 / 201114 | Fuse 5x20mm 1A 250VAC | +12V DC 1.5A | - + | GND | TX | RX | SWCLK | SWDIO | +3V3